# EAGLE design ADXL372_circuit (EAGLE 9.5.1)

## Sheet 1 of 2
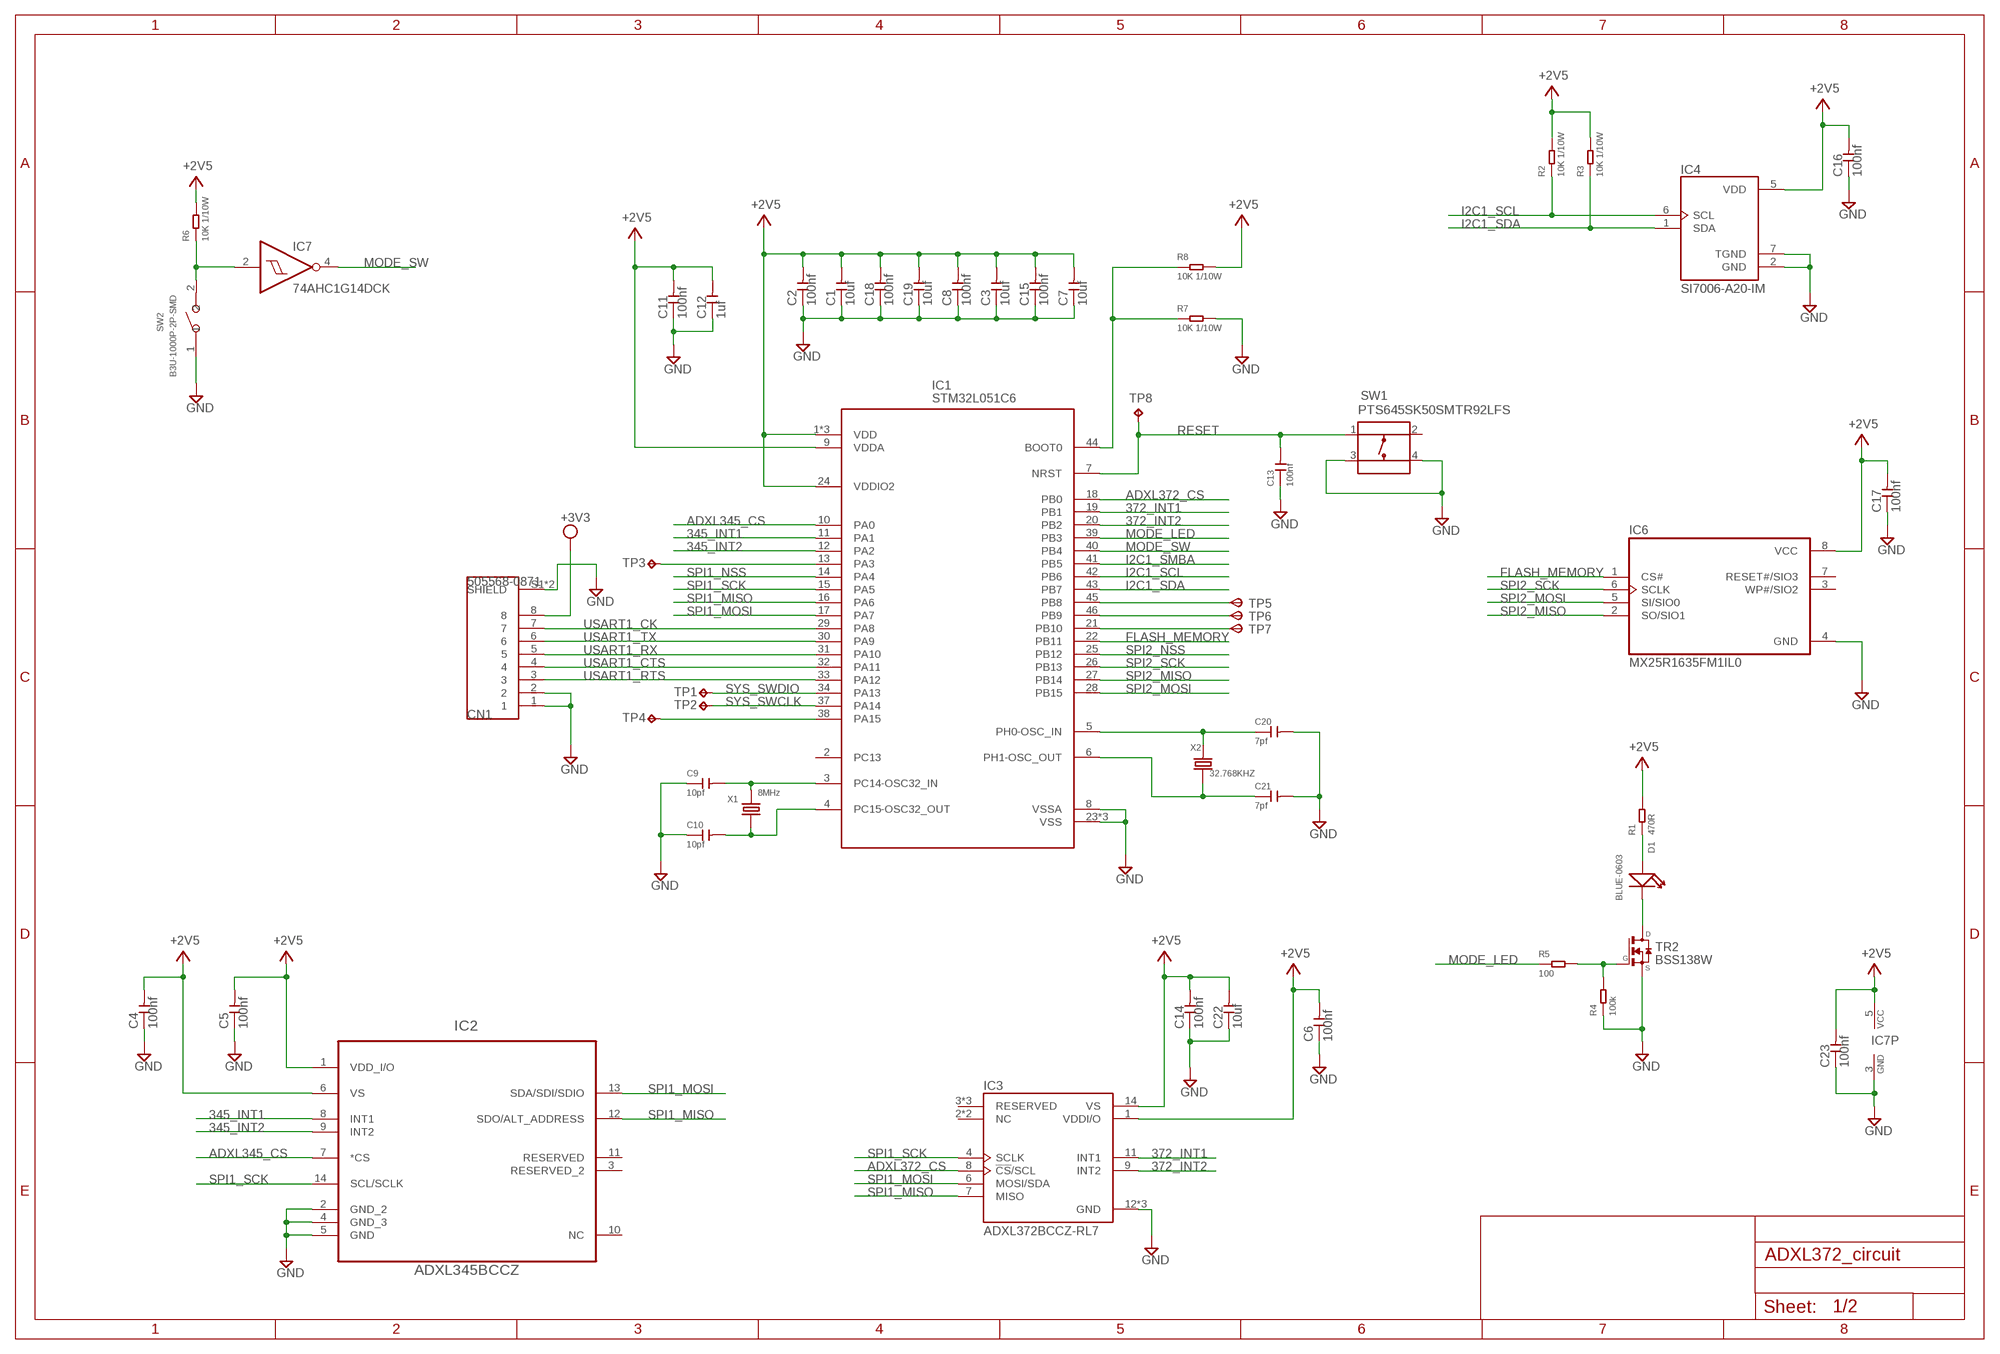
[diagram p0: schematic, sheet 1]

### Parts
C1  10uf  CERAMIC-10UF-10V-(-20%～+80%)-Y5V(0805)  [C0805]
C2  100nf  CERAMIC-100NF-50V-10%-X7R(0603)  [C0603]
C3  10uf  CERAMIC-10UF-10V-(-20%～+80%)-Y5V(0805)  [C0805]
C4  100nf  CERAMIC-100NF-50V-10%-X7R(0603)  [C0603]
C5  100nf  CERAMIC-100NF-50V-10%-X7R(0603)  [C0603]
C6  100nf  CERAMIC-100NF-50V-10%-X7R(0603)  [C0603]
C7  10uf  CERAMIC-10UF-10V-(-20%～+80%)-Y5V(0805)  [C0805]
C8  100nf  CERAMIC-100NF-50V-10%-X7R(0603)  [C0603]
C9  10pf  CERAMIC-10PF-50V-5%-NPO(0603)  [C0603]
C10  10pf  CERAMIC-10PF-50V-5%-NPO(0603)  [C0603]
C11  100nf  CERAMIC-100NF-50V-10%-X7R(0603)  [C0603]
C12  1uf  CERAMIC-1UF-25V-10%-X7R(0805)  [C0805]
C13  100nf  CERAMIC-100NF-50V-10%-X7R(0603)  [C0603]
C14  100nf  CERAMIC-100NF-50V-10%-X7R(0603)  [C0603]
C15  100nf  CERAMIC-100NF-50V-10%-X7R(0603)  [C0603]
C16  100nf  CERAMIC-100NF-50V-10%-X7R(0603)  [C0603]
C17  100nf  CERAMIC-100NF-50V-10%-X7R(0603)  [C0603]
C18  100nf  CERAMIC-100NF-50V-10%-X7R(0603)  [C0603]
C19  10uf  CERAMIC-10UF-10V-(-20%～+80%)-Y5V(0805)  [C0805]
C20  7pf  CERAMIC-10PF-50V-5%-NPO(0603)  [C0603]
C21  7pf  CERAMIC-10PF-50V-5%-NPO(0603)  [C0603]
C22  10uf  CERAMIC-10UF-10V-(-20%～+80%)-Y5V(0805)  [C0805]
C23  100nf  CERAMIC-100NF-50V-10%-X7R(0603)  [C0603]
CN1  505568-0871  [MOLEX_505568-0871]
D1  BLUE-0603  SMD-LED-CLEAR-BLUE(0603)  [LED-0603]
IC1  STM32L051C6  [LQFP48]
IC2  ADXL345BCCZ  [LGA14R80P3X6_300X500X100]
IC3  ADXL372BCCZ-RL7  [PQFN50P322X300X114-16N]
IC4  SI7006-A20-IM  [SON100P300X300X80-7N]
IC6  MX25R1635FM1IL0  [SOIC127P600X175-8N]
IC7  74AHC1G14DCK  [SC70-5]
R1  470R  SMD-RES-470R-5%-1/10W(0603)  [R0603]
R2  10K 1/10W  SMD-RES-10K-5%-1/10W(0603)  [R0603]
R3  10K 1/10W  SMD-RES-10K-5%-1/10W(0603)  [R0603]
R4  100k  SMD-RES-470R-5%-1/10W(0603)  [R0603]
R5  100  SMD-RES-470R-5%-1/10W(0603)  [R0603]
R6  10K 1/10W  SMD-RES-10K-5%-1/10W(0603)  [R0603]
R7  10K 1/10W  SMD-RES-10K-5%-1/10W(0603)  [R0603]
R8  10K 1/10W  SMD-RES-10K-5%-1/10W(0603)  [R0603]
SW1  PTS645SK50SMTR92LFS  [SW_PTS645SK50SMTR92LFS]
SW2  B3U-1000P-2P-SMD  SMD-BUTTON(2P-3.0X2.5X1.2+0.4MM)-B3U-1000P-2P-SMD  [SW2-2.6-3.0X2.5X1.2+0.4MM]
TP1  TPB1,27  [B1,27]
TP2  TPB1,27  [B1,27]
TP3  TPB1,27  [B1,27]
TP4  TPB1,27  [B1,27]
TP5  TPSB1,27  [B1,27]
TP6  TPSB1,27  [B1,27]
TP7  TPSB1,27  [B1,27]
TP8  TPB1,27  [B1,27]
TR2  BSS138W  [SOT323-R]
X1  8MHz  SMD-CRYSTAL-16MHZ-8PF-20PPM-40R(2P-5.0X3.2MM)  [X2-SMD-5.0X3.2X1.3MM]
X2  32.768KHZ  SMD-CRYSTAL-32.768KHZ-12.5PF-20PPM-90K(2P-L2.0X1.2MM)  [X2-SMD-L2.0X1.2X0.55MM]

### Nets
345_INT1: IC1.11(PA1) IC2.8(INT1)
345_INT2: IC1.12(PA2) IC2.9(INT2)
372_INT1: IC1.19(PB1) IC3.11(INT1)
372_INT2: IC1.20(PB2) IC3.9(INT2)
+2V5: C1.2 C2.2 C3.2 C4.2 C5.2 C6.2 C7.2 C8.2 C11.2 C12.2 C14.2 C15.2 C16.2 C17.2 C18.2 C19.2 C22.2 C23.2 IC1.1(VDD) IC1.9(VDDA) IC1.24(VDDIO2) IC1.36(VDD) IC1.48(VDD) IC2.1(VDD_I/O) IC2.6(VS) IC3.1(VDDI/O) IC3.14(VS) IC4.5(VDD) IC6.8(VCC) IC7.5(VCC) R1.2 R2.2 R3.2 R6.2 R8.2 ; also sheet 2
+3V3: CN1.8 ; also sheet 2
ADXL345_CS: IC1.10(PA0) IC2.7(*CS)
ADXL372_CS: IC1.18(PB0) IC3.8(!CS!/SCL)
FLASH_MEMORY: IC1.22(PB11) IC6.1(CS#)
GND: C1.1 C2.1 C3.1 C4.1 C5.1 C6.1 C7.1 C8.1 C9.1 C10.1 C11.1 C12.1 C13.1 C14.1 C15.1 C16.1 C17.1 C18.1 C19.1 C20.2 C21.2 C22.1 C23.1 CN1.1 CN1.2 CN1.S1(SHIELD) CN1.S2(SHIELD) IC1.8(VSSA) IC1.23(VSS) IC1.35(VSS) IC1.47(VSS) IC2.2(GND_2) IC2.4(GND_3) IC2.5(GND) IC3.12(GND) IC3.13(GND) IC3.16(GND) IC4.2(GND) IC4.7(TGND) IC6.4(GND) IC7.3(GND) R4.1 R7.2 SW1.3 SW1.4 SW2.1 TR2.2(S) ; also sheet 2
I2C1_SCL: IC1.42(PB6) IC4.6(SCL) R2.1
I2C1_SDA: IC1.43(PB7) IC4.1(SDA) R3.1
I2C1_SMBA: IC1.41(PB5)
MODE_LED: IC1.39(PB3) R5.1
MODE_SW: IC1.40(PB4) IC7.4(O)
N$1: C9.2 IC1.3(PC14-OSC32_IN) X1.2
N$2: C10.2 IC1.4(PC15-OSC32_OUT) X1.1
N$4: R4.2 R5.2 TR2.1(G)
N$5: IC7.2(I) R6.1 SW2.2
N$6: IC1.13(PA3) TP3.TP
N$7: IC1.38(PA15) TP4.TP
N$12: IC1.44(BOOT0) R7.1 R8.1
N$14: C20.1 IC1.5(PH0-OSC_IN) X2.2
N$15: C21.1 IC1.6(PH1-OSC_OUT) X2.1
N$18: D1.+ R1.1
N$19: D1.- TR2.3(D)
RESET: C13.2 IC1.7(NRST) SW1.1 TP8.TP
SPI1_MISO: IC1.16(PA6) IC2.12(SDO/ALT_ADDRESS) IC3.7(MISO)
SPI1_MOSI: IC1.17(PA7) IC2.13(SDA/SDI/SDIO) IC3.6(MOSI/SDA)
SPI1_NSS: IC1.14(PA4)
SPI1_SCK: IC1.15(PA5) IC2.14(SCL/SCLK) IC3.4(SCLK)
SPI2_MISO: IC1.27(PB14) IC6.2(SO/SIO1)
SPI2_MOSI: IC1.28(PB15) IC6.5(SI/SIO0)
SPI2_NSS: IC1.25(PB12)
SPI2_SCK: IC1.26(PB13) IC6.6(SCLK)
SYS_SWCLK: IC1.37(PA14) TP2.TP
SYS_SWDIO: IC1.34(PA13) TP1.TP
TP5: IC1.45(PB8) TP5.TP(PP)
TP6: IC1.46(PB9) TP6.TP(PP)
TP7: IC1.21(PB10) TP7.TP(PP)
USART1_CK: CN1.7 IC1.29(PA8)
USART1_CTS: CN1.4 IC1.32(PA11)
USART1_RTS: CN1.3 IC1.33(PA12)
USART1_RX: CN1.5 IC1.31(PA10)
USART1_TX: CN1.6 IC1.30(PA9)
Unconnected: IC1.2(PC13) IC2.3(RESERVED_2) IC2.10(NC) IC2.11(RESERVED) IC3.2(NC) IC3.3(RESERVED) IC3.5(RESERVED) IC3.10(RESERVED) IC3.15(NC) IC6.3(WP#/SIO2) IC6.7(RESET#/SIO3) SW1.2

## Sheet 2 of 2
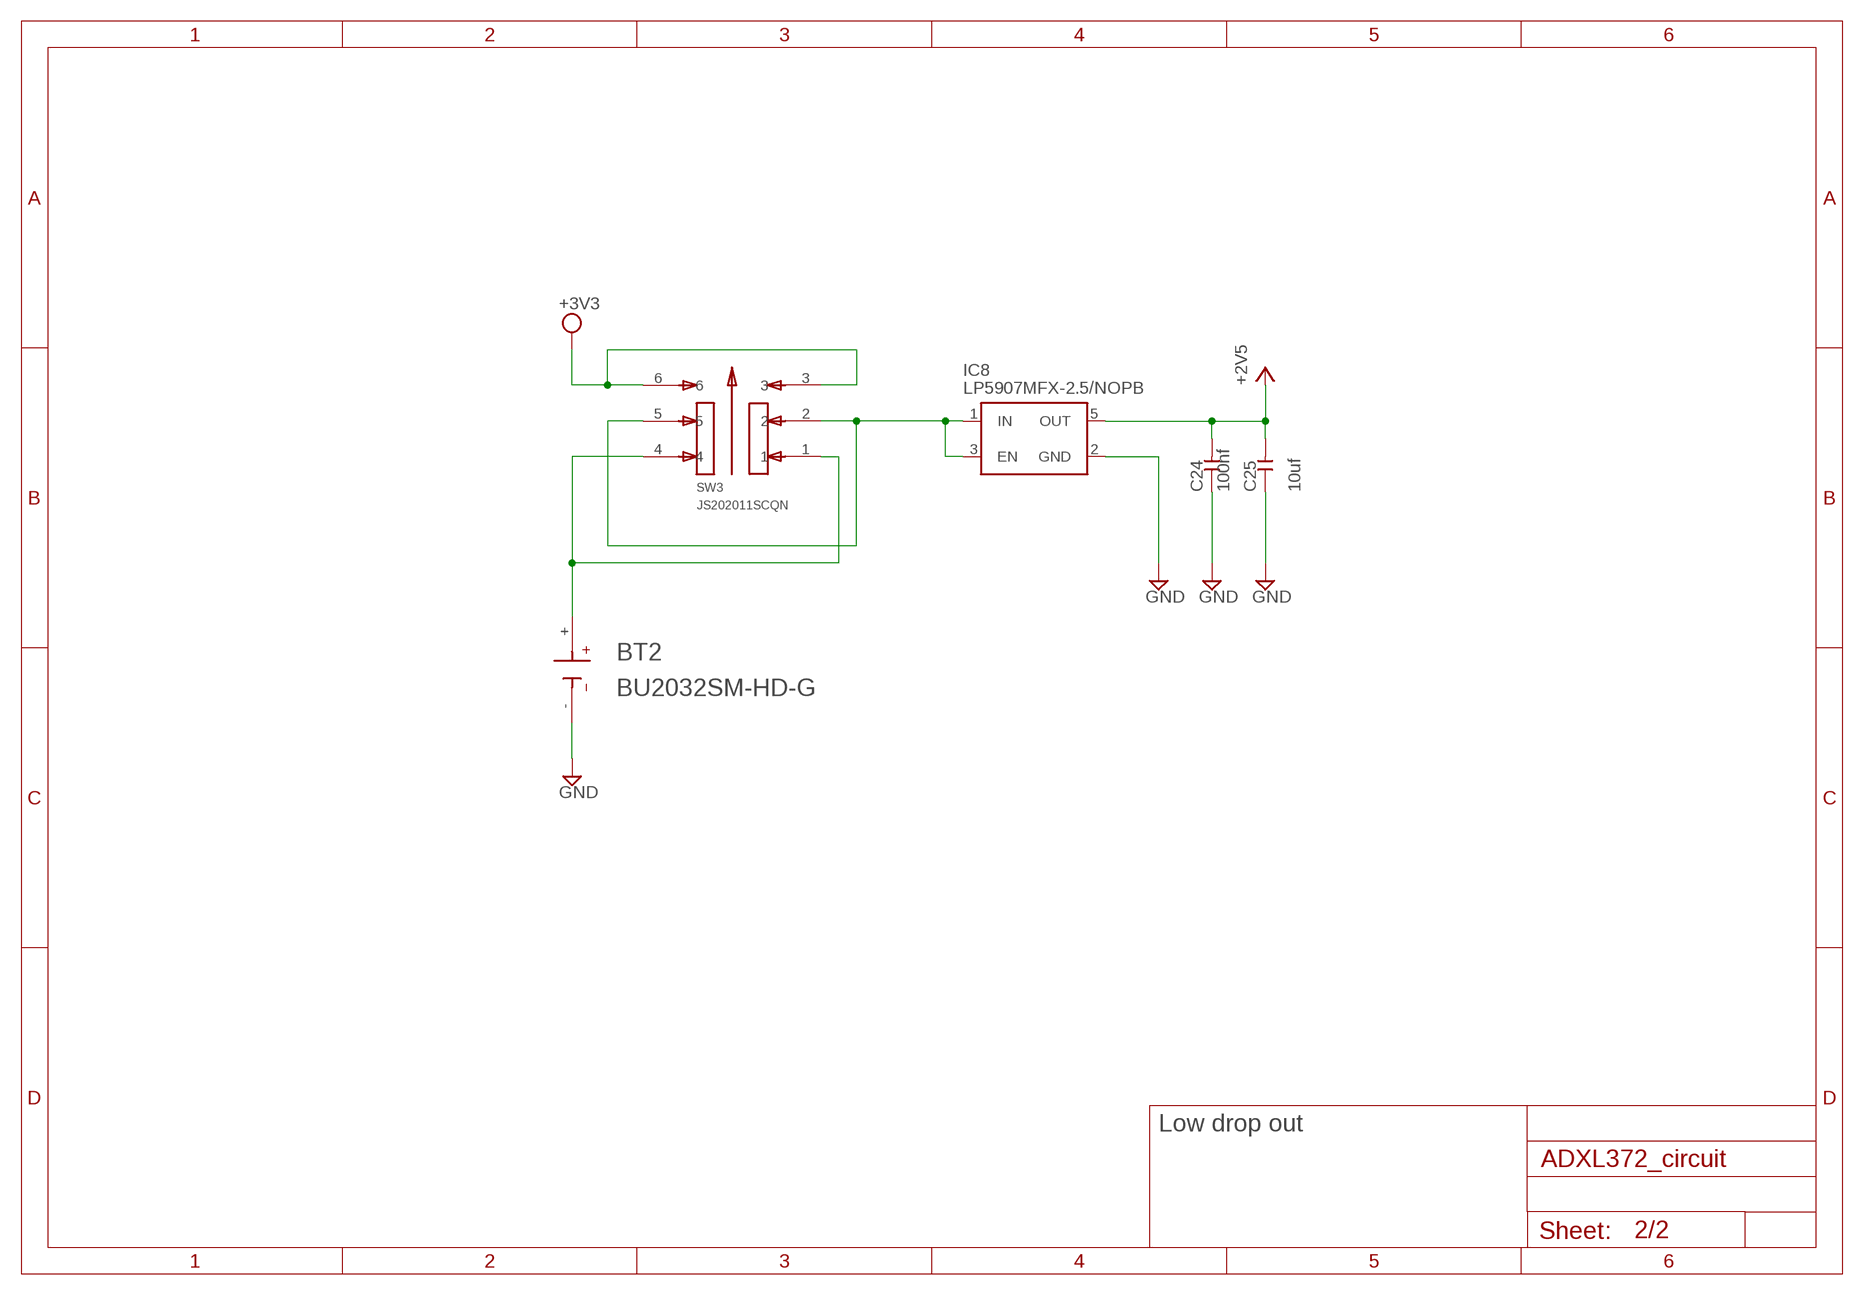
[diagram p1: schematic, sheet 2]

### Parts
BT2  BU2032SM-HD-G  [BAT_BU2032SM-HD-G]
C24  100nf  CERAMIC-100NF-50V-10%-X7R(0603)  [C0603]
C25  10uf  CERAMIC-10UF-10V-(-20%～+80%)-Y5V(0805)  [C0805]
IC8  LP5907MFX-2.5/NOPB  [SOT95P280X145-5N]
SW3  JS202011SCQN  [SW_JS202011SCQN]

### Nets
+2V5: C24.2 C25.2 IC8.5(OUT) ; also sheet 1
+3V3: SW3.3 SW3.6 ; also sheet 1
+BAT: BT2.+ SW3.1 SW3.4
+VIN: IC8.1(IN) IC8.3(EN) SW3.2 SW3.5
GND: BT2.- C24.1 C25.1 IC8.2(GND) ; also sheet 1

### Notes on the sheet
- Low drop out

## Library data of the parts
BT2 = BU2032SM-HD-G:BU2032SM-HD-G: Batt Holder Smt Coin 20mm Tape; DESCRIPTION: BATTERY HOLDER COIN 20MM SMD; DIGI-KEY_PART_NUMBER: BU2032SM-HD-GCT-ND; DIGI-KEY_PURCHASE_URL: https://www.digikey.jp/product-detail/en/mpd-memory-protection-devices/BU2032SM-HD-G/BU2032SM-HD-GCT-ND/755451?utm_source=snapeda&utm_medium=aggregator&utm_campaign=symbol; MF: MPD _Memory; MP: BU2032SM-HD-G; PACKAGE: None
C1 C3 C7 C19 C22 C25 = OPL_Capacitor:CERAMIC-10UF-10V-(-20%～+80%)-Y5V(0805): 302010158; MPN: CC0805ZKY5V6BB106
C2 C4-C6 C8 C11 C13-C18 C23 C24 = OPL_Capacitor:CERAMIC-100NF-50V-10%-X7R(0603): 302010138; MPN: CC0603KRX7R9BB104
C9 C10 = OPL_Capacitor:CERAMIC-10PF-50V-5%-NPO(0603): 302010097; MPN: CC0603JRNPO9BN100
C12 = OPL_Capacitor:CERAMIC-1UF-25V-10%-X7R(0805): 302010179; MPN: CC0805KKX7R8BB105
C20 C21 = OPL_Capacitor:CERAMIC-10PF-50V-5%-NPO(0603): 302010097; MPN: CC0603JRNPO9BN100; VALUE: 10pf
CN1 = 505568-0871:505568-0871: Micro-Lock PLUS Vertical Header 1.25mm Pitch Single Row 8 Circuits Tin-Bismuth Plating Polyamide Black Emboss T/R; AVAILABILITY: Unavailable; DESCRIPTION: Headers & Wire Housings MicroLockPlus 1.25MM VERT HDR SR 8CKT BLK; MF: Molex; MP: 505568-0871; PACKAGE: None; PRICE: None
D1 = Seeed-LED:SMD-LED-CLEAR-BLUE(0603): 304090045; MPN: 19-217-BHC-ZL1M2RY-3T
IC1 = stm32l05x6:STM32L051C6
IC2 = ADXL345BCCZ:ADXL345BCCZ: IC, ACCELEROMETER, 3AXIS; DESCRIPTION: Lga 14/i¡/Small, Ultra Low Power, 3-Axis, ±2/4/8/16g Digital Accelerometer; DIGI-KEY_PART_NUMBER: ADXL345BCCZ-ND; DIGI-KEY_PURCHASE_URL: https://www.digikey.jp/product-detail/en/analog-devices-inc/ADXL345BCCZ/ADXL345BCCZ-ND/2034829?utm_source=snapeda&utm_medium=aggregator&utm_campaign=symbol; MF: Analog Devices; MP: ADXL345BCCZ; PACKAGE: LGA-14 Analog Devices
IC3 = ADXL372BCCZ-RL7:ADXL372BCCZ-RL7: Micropower, 3-Axis, ±200 g Digital Output, MEMS; DIGI-KEY_PART_NUMBER: ADXL372BCCZ-RL7CT-ND; DIGI-KEY_PURCHASE_URL: https://www.digikey.jp/product-detail/en/analog-devices-inc/ADXL372BCCZ-RL7/ADXL372BCCZ-RL7CT-ND/7019671?utm_source=snapeda&utm_medium=aggregator&utm_campaign=symbol; MF: Analog Devices; MP: ADXL372BCCZ-RL7; PACKAGE: LGA-16 Analog Devices
IC4 = SI7006-A20-IM:SI7006-A20-IM: SENS HUMI/TEMP 3.6V I2C 5% 6DFN; AVAILABILITY: Unavailable; DESCRIPTION: Temp/Humidity Sensor, +/-1deg c, Dfn-6; MF: Silicon Labs; MP: SI7006-A20-IM; PACKAGE: DFN-6 Silicon Labs; PRICE: None
IC6 = MX25R1635FM1IL0:MX25R1635FM1IL0: None; AVAILABILITY: Unavailable; DESCRIPTION: 16 Mb NOR Serial flash 8-SOIC 1.65-3.6 VOLT ULTRA LOW POWER; MF: Macronix; MP: MX25R1635FM1IL0; PACKAGE: SOP-8 Macronix; PRICE: None
IC7 = 74xx-little-us:74*1G14: Single Schmitt-Trigger Inverter Gate
IC8 = LP5907MFX-2.5_NOPB:LP5907MFX-2.5/NOPB: 250mA, Ultra-Low Noise Low-Dropout egulator 5-SOT-23 -40 to 125; DESCRIPTION: 250mA, Ultra-Low Noise Low-Dropout egulator 5-SOT-23 -40 to 125; DIGI-KEY_PART_NUMBER: 296-40356-1-ND; DIGI-KEY_PURCHASE_URL: https://www.digikey.jp/product-detail/en/texas-instruments/LP5907MFX-2.5-NOPB/296-40356-1-ND/5178233?utm_source=snapeda&utm_medium=aggregator&utm_campaign=symbol; MF: Texas Instruments; MP: LP5907MFX-2.5/NOPB; PACKAGE: SOT-23 Texas Instruments
R1 = OPL_Resistor:SMD-RES-470R-5%-1/10W(0603): 301010088; MPN: RC0603JR-07470RL
R2 R3 R6-R8 = OPL_Resistor:SMD-RES-10K-5%-1/10W(0603): 301010293; MPN: RC0603JR-0710KL
R4 R5 = OPL_Resistor:SMD-RES-470R-5%-1/10W(0603): 301010088; MPN: RC0603JR-07470RL; VALUE: 470R
SW1 = PTS645SK50SMTR92LFS:PTS645SK50SMTR92LFS: Switch Tactile N.O. SPST Round Button Gull Wing 0.05A 12VDC 100000Cycles 2.55N SMD T/R; AVAILABILITY: Unavailable; DESCRIPTION: Switch Tactile N.O. SPST Round Button Gull Wing 0.05A 12VDC 100000Cycles 2.55N SMD T/R; MF: C&K; MP: PTS645SK50SMTR92LFS; PACKAGE: None; PRICE: None
SW2 = OPL_Switch:SMD-BUTTON(2P-3.0X2.5X1.2+0.4MM): 311020047; MPN: B3U-1000P-2P-SMD
SW3 = JS202011SCQN:JS202011SCQN: JS Series DPDT On-On Gull Wing Surface Mount Subminiature Slide Switch; DESCRIPTION: JS Series DPDT On-On Gull Wing Surface Mount Subminiature Slide Switch; DIGI-KEY_PART_NUMBER: 401-2002-1-ND; DIGI-KEY_PURCHASE_URL: https://www.digikey.jp/product-detail/en/c-k/JS202011SCQN/401-2002-1-ND/1640098?utm_source=snapeda&utm_medium=aggregator&utm_campaign=symbol; MF: C&K; MP: JS202011SCQN; PACKAGE: None
TP1-TP4 TP8 = testpad:TP: Test pad
TP5-TP7 = testpad:TPS: TEST PIN
TR2 = BSS138W:BSS138W: N-Channel MOSFET; DESCRIPTION: N-Channel 50 V 3.5 Ohm SMT Enhancement Mode Field Effect Transistor - SOT-323; DIGI-KEY_PART_NUMBER: BSS138WCT-ND; DIGI-KEY_PURCHASE_URL: https://www.digikey.jp/product-detail/en/on-semiconductor/BSS138W/BSS138WCT-ND/3907886?utm_source=snapeda&utm_medium=aggregator&utm_campaign=symbol; MF: ON Semiconductor; MP: BSS138W; PACKAGE: SOT-323 ON Semiconductor
X1 = OPL_Crystal Oscillator:SMD-CRYSTAL-16MHZ-8PF-20PPM-40R(2P-5.0X3.2MM): 306010054; MPN: X053201602002; VALUE: 16MHZ
X2 = OPL_Crystal Oscillator:SMD-CRYSTAL-32.768KHZ-12.5PF-20PPM-90K(2P-L2.0X1.2MM): 306010020; MPN: FC-12M; VALUE: 3.2768KHZ

## Net classes
0 default: width 0.152 mm, clearance 0.205 mm

## Board
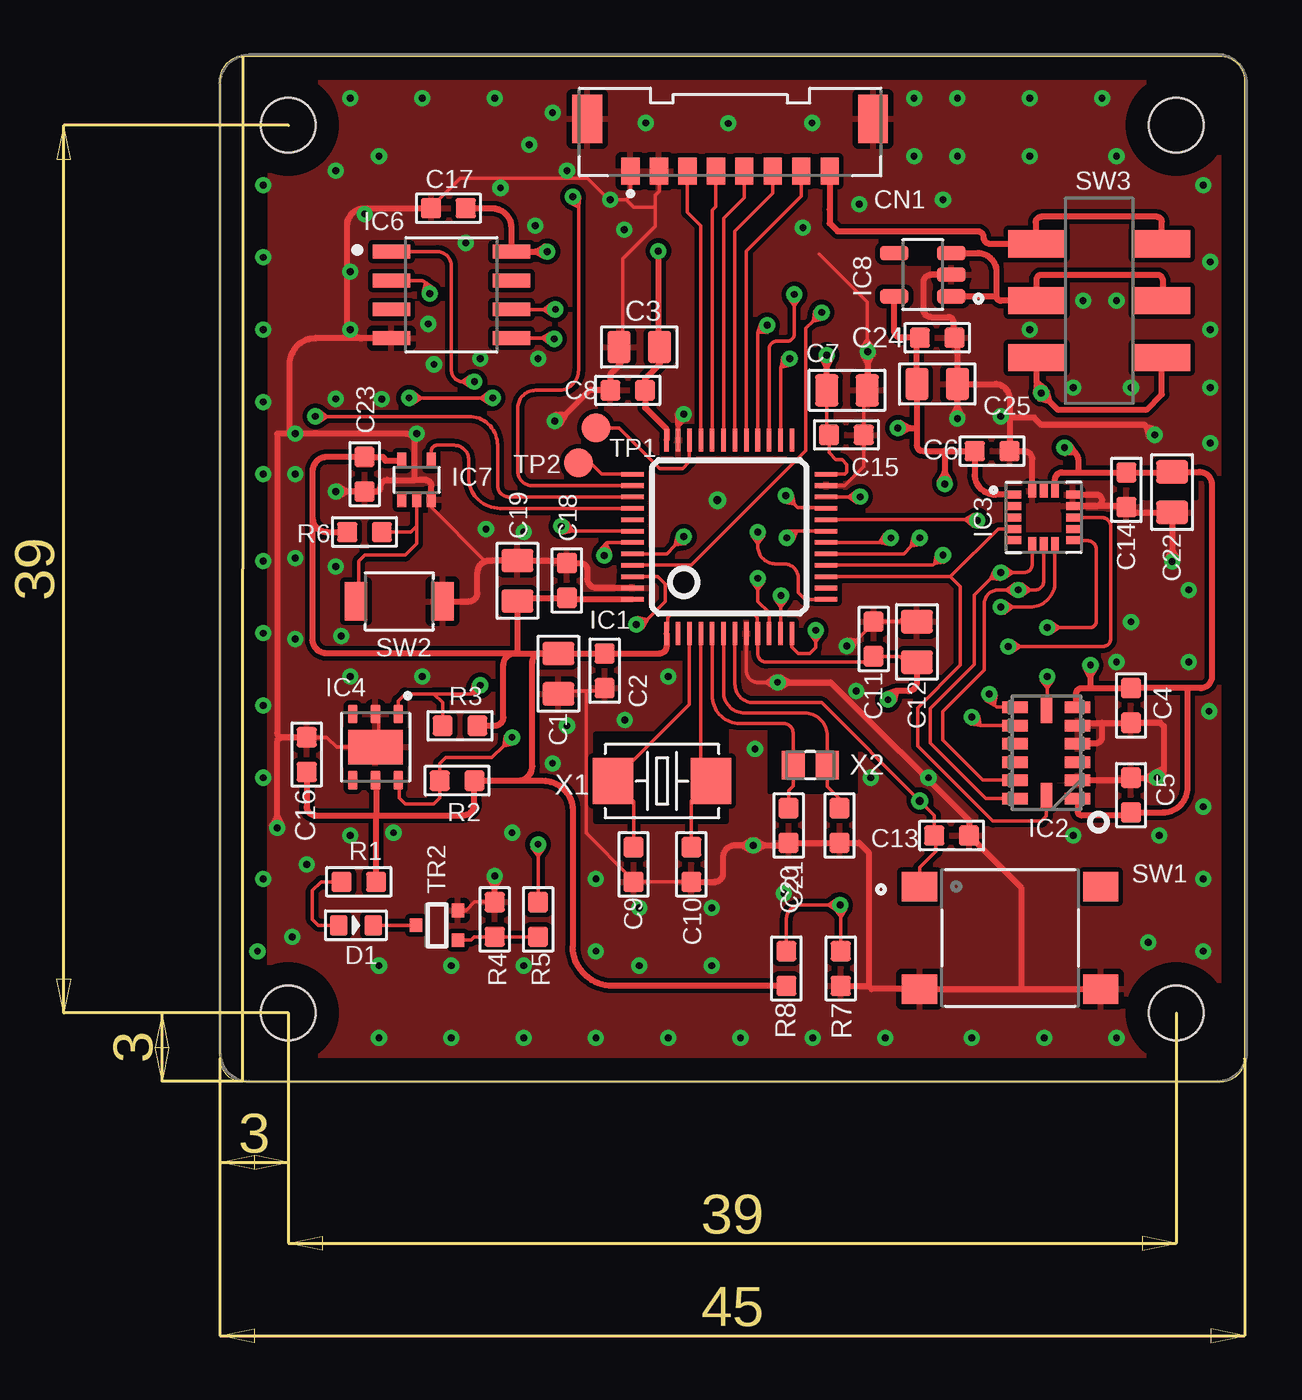
[diagram p2: board, top side]
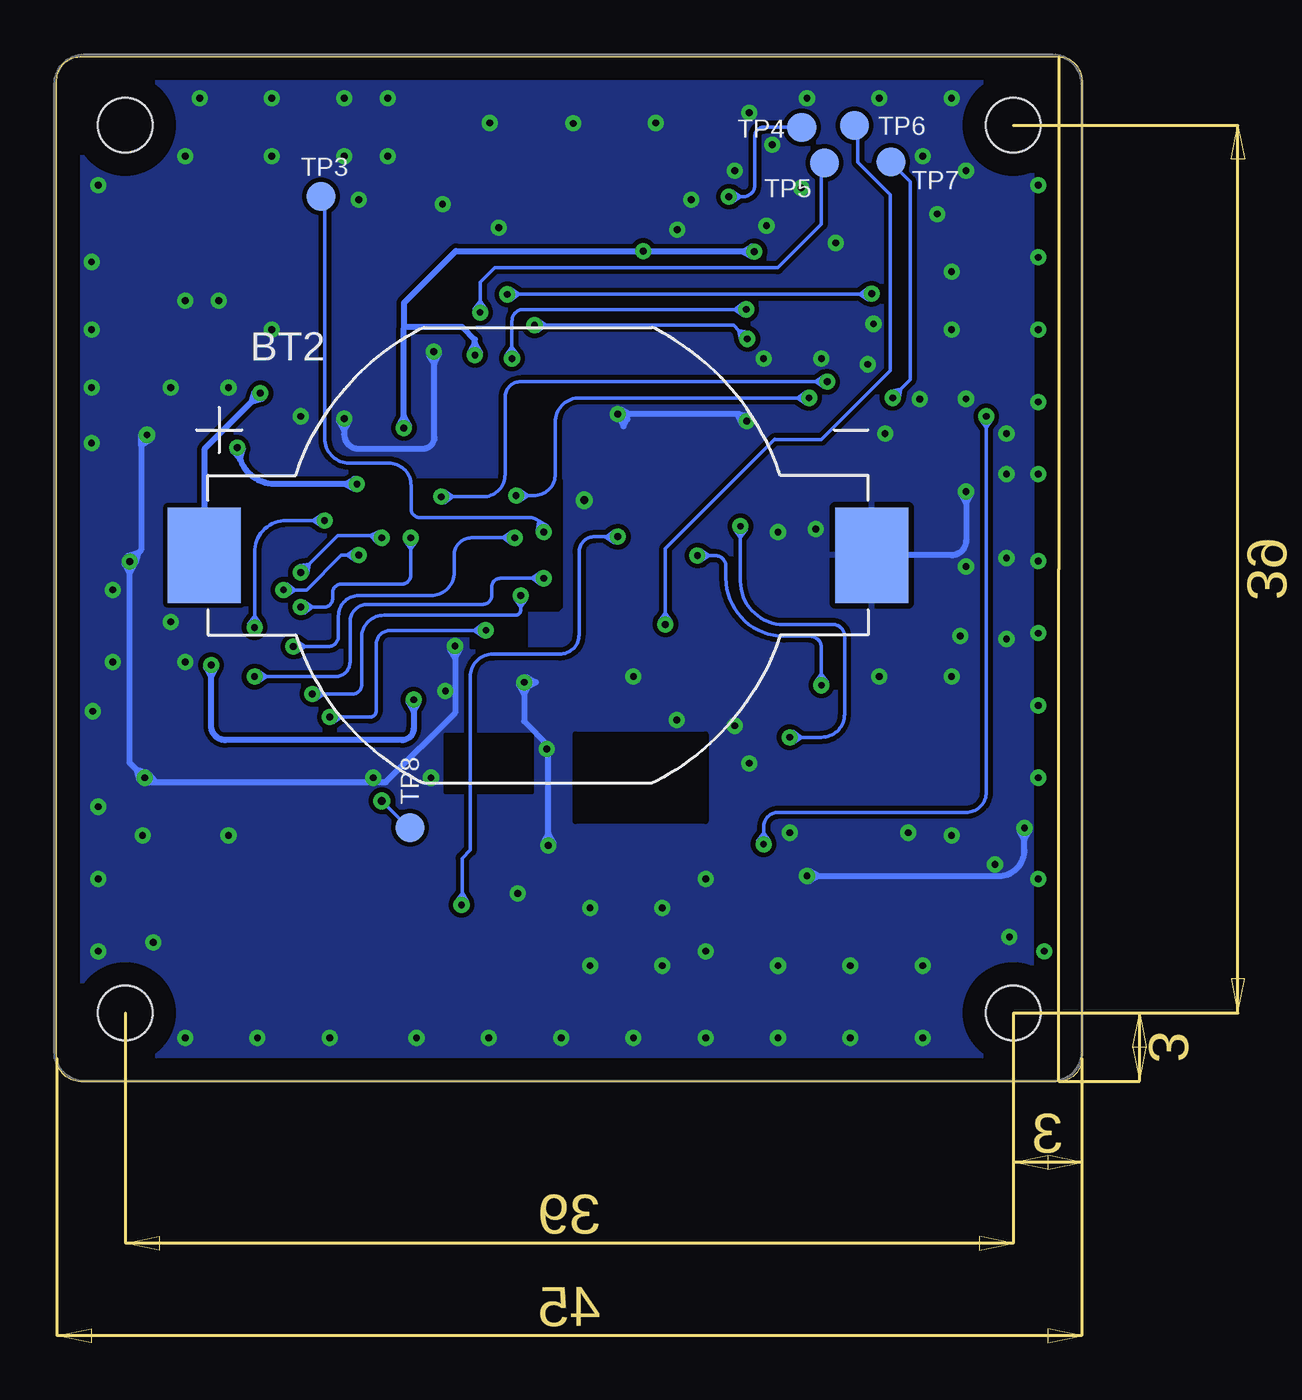
[diagram p3: board, bottom side, seen from below]

Size 45 x 45 mm. Coordinates in mm from the lower left corner, seen from the top.
Outline: 0,44 0,1 arc90 1,0 44,0 arc90 45,1 45,44 arc90 44,45 1,45 arc90 0,44
Copper layers (1*16): Top 0.035mm / dielectric 1.5mm / Bottom 0.035mm
Design rules "default *": minimum track width 6mil, minimum drill 0.3mm, track to track 4mil, track to pad 4mil, pad to pad 4mil, via to via 6mil, smd to smd 4mil, copper to edge 40mil, drill to drill 6mil, minimum pad ring 10mil, minimum via ring 8mil, stop-mask expansion 4mil, vias tented up to drill 0mil, thermal gap 10mil
Holes 2.4 mm at 3,3 42,3 3,42 42,42

### Footprints (pad centres in the part's own frame; a part is rotated, then mirrored left to right if it is on the bottom)
BAT_BU2032SM-HD-G = smd 3.2 x 4.2: + -14.65,0; - 14.65,0
C0805 = smd 1.397 x 1.016: 1 0,0.889; 2 0,-0.889
C0603 = smd 0.889 x 0.889: 1 0,0.762; 2 0,-0.762
MOLEX_505568-0871 = smd 0.8 x 1.2: 1 -4.375,0; 2 -3.125,0; 3 -1.875,0; 4 -0.625,0; 5 0.625,0; 6 1.875,0; 7 3.125,0; 8 4.375,0 | smd 1.3 x 2.15: S1 -6.275,2.295; S2 6.275,2.295
LED-0603 = smd 0.762 x 0.889: + -0.762,0; - 0.762,0
LQFP48 = smd 0.2 x 1: 1 -2.75,-4.25; 2 -2.25,-4.25; 3 -1.75,-4.25; 4 -1.25,-4.25; 5 -0.75,-4.25; 6 -0.25,-4.25; 7 0.25,-4.25; 8 0.75,-4.25; 9 1.25,-4.25; 10 1.75,-4.25; 11 2.25,-4.25; 12 2.75,-4.25; 25 2.75,4.25; 26 2.25,4.25; 27 1.75,4.25; 28 1.25,4.25; 29 0.75,4.25; 30 0.25,4.25; 31 -0.25,4.25; 32 -0.75,4.25; 33 -1.25,4.25; 34 -1.75,4.25; 35 -2.25,4.25; 36 -2.75,4.25 | smd 1 x 0.2: 13 4.25,-2.75; 14 4.25,-2.25; 15 4.25,-1.75; 16 4.25,-1.25; 17 4.25,-0.75; 18 4.25,-0.25; 19 4.25,0.25; 20 4.25,0.75; 21 4.25,1.25; 22 4.25,1.75; 23 4.25,2.25; 24 4.25,2.75; 37 -4.25,2.75; 38 -4.25,2.25; 39 -4.25,1.75; 40 -4.25,1.25; 41 -4.25,0.75; 42 -4.25,0.25; 43 -4.25,-0.25; 44 -4.25,-0.75; 45 -4.25,-1.25; 46 -4.25,-1.75; 47 -4.25,-2.25; 48 -4.25,-2.75
LGA14R80P3X6_300X500X100 = smd 1.118 x 0.508: 1 -1.372,2.007; 2 -1.372,1.194; 3 -1.372,0.406; 4 -1.372,-0.406; 5 -1.372,-1.194; 6 -1.372,-2.007; 8 1.372,-2.007; 9 1.372,-1.194; 10 1.372,-0.406; 11 1.372,0.406; 12 1.372,1.194; 13 1.372,2.007 | smd 0.508 x 1.118: 7 0,-1.88; 14 0,1.88
PQFN50P322X300X114-16N = smd 0.6 x 0.35: 1 -1.285,1; 2 -1.285,0.5; 3 -1.285,0; 4 -1.285,-0.5; 5 -1.285,-1; 9 1.285,-1; 10 1.285,-0.5; 11 1.285,0; 12 1.285,0.5; 13 1.285,1 | smd 0.35 x 0.6: 6 -0.5,-1.165; 7 0,-1.165; 8 0.5,-1.165; 14 0.5,1.165; 15 0,1.165; 16 -0.5,1.165
SON100P300X300X80-7N = smd 0.81 x 0.42: 1 -1.45,1; 2 -1.45,0; 3 -1.45,-1; 4 1.45,-1; 5 1.45,0; 6 1.45,1 | smd 1.5 x 2.4: 7 0,0
SOIC127P600X175-8N = smd 1.65 x 0.61: 1 -2.635,1.905; 2 -2.635,0.635; 3 -2.635,-0.635; 4 -2.635,-1.905; 5 2.635,-1.905; 6 2.635,-0.635; 7 2.635,0.635; 8 2.635,1.905
SC70-5 = smd 0.4 x 0.7: 1 -0.65,-0.85; 2 0,-0.85; 3 0.65,-0.85; 4 0.65,0.85; 5 -0.65,0.85
SOT95P280X145-5N = smd 1.27 x 0.635: 1 -1.255,0.95; 2 -1.255,0; 3 -1.255,-0.95; 4 1.255,-0.95; 5 1.255,0.95
R0603 = smd 0.889 x 0.889: 1 0,0.762; 2 0,-0.762
SW_PTS645SK50SMTR92LFS = smd 1.55 x 1.3: 1 -3.975,2.25; 2 3.975,2.25; 3 -3.975,-2.25; 4 3.975,-2.25
SW2-2.6-3.0X2.5X1.2+0.4MM = smd 1 x 1.7: 1 -1.9,0; 2 1.9,0
SW_JS202011SCQN = smd 1.2 x 2.5: 1 -2.5,-2.75; 2 0,-2.75; 3 2.5,-2.75; 4 -2.5,2.75; 5 0,2.75; 6 2.5,2.75
B1,27 = smd 1.27 x 1.27: TP 0,0
SOT323-R = smd 0.6 x 0.55: 1 -0.65,-0.925; 2 0.65,-0.925; 3 0,0.925
X2-SMD-5.0X3.2X1.3MM = smd 1.778 x 2.032: 1 -2.159,0; 2 2.159,0
X2-SMD-L2.0X1.2X0.55MM = smd 1 x 1.25: 1 -0.75,0; 2 0.75,0

### Placement (x,y rotation side)
BT2  23.88,23.11 0 bottom
C1  14.86,17.91 180 top
C2  16.89,18.03 180 top
C3  18.41,32.26 90 top
C4  40.01,16.51 180 top
C5  40.01,12.57 0 top
C6  33.91,27.69 270 top
C7  27.53,30.35 270 top
C8  17.91,30.35 90 top
C9  18.16,9.53 180 top
C10  20.7,9.53 180 top
C11  28.7,19.43 0 top
C12  30.61,19.3 0 top
C13  32.13,10.79 270 top
C14  39.8,25.98 180 top
C15  27.51,28.4 270 top
C16  3.81,14.35 0 top
C17  10.03,38.35 90 top
C18  15.24,22 0 top
C19  13.06,21.99 0 top
C20  24.97,11.24 0 top
C21  27.21,11.24 0 top
C22  41.81,25.88 180 top
C23  6.35,26.67 180 top
C24  31.5,32.66 270 top
C25  31.5,30.63 270 top
CN1  22.4,39.98 0 top
D1  5.97,6.86 0 top
IC1  22.36,23.92 0 top
IC2  36.29,14.43 180 top
IC3  36.17,24.77 0 top
IC4  6.83,14.68 270 top
IC6  10.16,34.54 0 top
IC7  8.64,26.42 0 top
IC8  30.86,35.43 180 top
R1  6.1,8.76 90 top
R2  10.41,13.21 90 top
R3  10.54,15.62 90 top
R4  12.06,7.11 0 top
R5  13.97,7.11 0 top
R6  6.35,24.13 270 top
R7  27.26,4.95 0 top
R8  24.87,4.95 0 top
SW1  34.7,6.3 0 top
SW2  7.87,21.08 180 top
SW3  38.61,34.29 90 top
TP1  16.51,28.7 0 top
TP2  15.75,27.18 0 top
TP3  33.4,38.86 0 bottom
TP4  12.29,41.91 0 bottom
TP5  11.3,40.34 0 bottom
TP6  9.98,41.99 0 bottom
TP7  8.38,40.39 0 bottom
TP8  29.49,11.15 0 bottom
TR2  9.53,6.86 90 top
X1  19.41,13.19 180 top
X2  25.92,13.89 180 top

### Tracks (layer width: path | path; a pad name or v marks a point on that pad's centre or on a via)
345_INT1  (via drill 0.3)
  Top 0.152: IC2.8 34.11,16.44 34,16.54 | v33.78,17.02 33.78,16.76 34,16.54 | IC1.11 24.61,20.81 | 24.61,20.81 24.61,21.31 v24.64,21.34 | 24.61,20.81 24.88,21.15 v24.64,21.34 | 24.61,20.81 24.38,21.17 v24.64,21.34 | 34,16.54 | 34,16.54 | 34,16.54 33.63,16.76 | 33.63,16.76 | 34,16.54 34.08,16.96 | 34.08,16.96 | v33.78,17.02 34.08,16.96 | 34,16.54 33.63,16.76 | v33.78,17.02 33.63,16.76 | 34,16.54 34.08,16.96 | v33.78,17.02 34.08,16.96 | 34,16.54 33.63,16.76 | v33.78,17.02 33.63,16.76
  Bottom 0.152: v33.78,17.02 33.26,17.02 | 33.26,17.02 32,17.02 arc-90 31.62,17.4 31.62,19.49 arc90 30.64,20.48 24.86,20.48 arc-90 24.64,20.7 24.64,20.81 | v24.64,21.34 24.64,20.81 | 24.64,20.81 24.89,21.16 v24.64,21.34 | 24.64,20.81 24.39,21.16 v24.64,21.34 | 33.26,17.02 33.61,16.77 v33.78,17.02 | 33.26,17.02 33.61,17.27 v33.78,17.02
345_INT2  (via drill 0.3)
  Top 0.152: 33.39,15.63 33.4,15.62 IC2.9 | 33.39,15.63 v33.02,16 | 26.16,19.29 26.16,19.05 25.91,18.8 25.4,18.8 25.11,19.08 IC1.12 | 26.16,19.29 | 26.16,19.29 v26.16,19.81 | 26.16,19.29 26.41,19.64 | 26.41,19.64 | 26.16,19.29 | 26.16,19.29 25.91,19.64 | 25.91,19.64 | 26.16,19.29 26.41,19.64 | 26.41,19.64 | v26.16,19.81 26.41,19.64 | 26.16,19.29 25.91,19.64 | v26.16,19.81 25.91,19.64 | 26.16,19.29 26.41,19.64 | v26.16,19.81 26.41,19.64 | 26.16,19.29 25.91,19.64 | v26.16,19.81 25.91,19.64 | 33.39,15.63 33.32,16.05 v33.02,16 | 33.39,15.63 32.97,15.7 v33.02,16
  Bottom 0.152: v26.16,19.81 26.69,19.81 | 26.69,19.81 | 26.69,19.81 30.35,19.81 arc-90 30.99,19.18 30.99,16.26 arc90 31.24,16 32.49,16 | 32.49,16 v33.02,16 | 26.69,19.81 26.34,20.06 | 26.34,20.06 | 26.69,19.81 | 26.69,19.81 26.34,19.57 | 26.34,19.57 | 26.69,19.81 26.34,20.06 | 26.34,20.06 | v26.16,19.81 26.34,20.06 | 26.69,19.81 26.34,19.57 | v26.16,19.81 26.34,19.57 | 26.69,19.81 26.34,20.06 | v26.16,19.81 26.34,20.06 | 26.69,19.81 26.34,19.57 | v26.16,19.81 26.34,19.57 | 32.49,16 32.85,15.76 v33.02,16 | 32.49,16 32.85,16.25 v33.02,16
372_INT1  (via drill 0.3)
  Top 0.152: v34.62,19.1 35.15,19.1 | 35.15,19.1 38.76,19.1 arc90 39.12,19.46 39.12,24.38 arc90 38.73,24.77 IC3.11 arc-90 IC3.11 | v24.89,23.88 arc-90 25.18,24.17 25.33,24.17 | 25.33,24.17 IC1.19 | 25.33,24.17 24.9,24.18 v24.89,23.88 | 25.33,24.17 25.17,23.77 v24.89,23.88 | 35.15,19.1 34.79,19.35 v34.62,19.1 | 35.15,19.1 34.79,18.85 v34.62,19.1
  Bottom 0.152: v24.89,23.88 25.42,23.88 | 25.42,23.88 26.8,23.88 arc-90 27.56,23.11 27.56,22.35 arc90 28.57,21.34 31.75,21.34 arc-90 32.64,20.45 32.64,19.56 arc90 33.1,19.1 34.09,19.1 | v34.62,19.1 34.09,19.1 | 25.42,23.88 25.07,24.12 v24.89,23.88 | 25.42,23.88 25.07,23.63 v24.89,23.88 | 34.09,19.1 34.45,18.85 v34.62,19.1 | 34.09,19.1 34.45,19.35 v34.62,19.1
372_INT2  (via drill 0.3)
  Top 0.152: v33.25,24.64 33.22,24.67 32.73,24.67 | 32.73,24.67 IC1.20 | v36.32,19.94 36.85,19.94 | 36.85,19.94 38.23,19.94 arc90 38.48,20.19 38.48,23.37 arc90 38.1,23.75 37.47,23.75 arc-90 IC3.9 | 32.73,24.67 33.06,24.4 v33.25,24.64 | 32.73,24.67 33.09,24.89 v33.25,24.64 | 36.85,19.94 36.5,20.19 v36.32,19.94 | 36.85,19.94 36.5,19.69 v36.32,19.94
  Bottom 0.152: v33.25,24.64 33.77,24.64 | 33.77,24.64 34.92,24.64 arc-90 36.32,23.24 36.32,20.46 | 36.32,20.46 v36.32,19.94 | 33.77,24.64 33.42,24.89 v33.25,24.64 | 33.77,24.64 33.42,24.39 v33.25,24.64 | 36.32,20.46 36.08,20.11 v36.32,19.94 | 36.32,20.46 36.57,20.11 v36.32,19.94
+2V5  (via drill 0.3)
  Top 0.152: 15.09,21.1 C18.2 | IC4.5 6.86,13.2 | C12.2 30.1,18.41 29.84,18.67 C11.2 28.45,18.41 24,18.41 arc-90 23.61,18.8 IC1.9 23.59,19.84 23.59,20.37 23.41,20.55 19.84,20.55 19.66,20.37 19.66,19.84 IC1.1 | IC1.24 27.43,26.67 27.53,26.77 27.53,27.1 27.33,27.3 27.05,27.3 26.75,27.61 C15.2 26.64,28.5 C7.2
  Top 0.254: IC3.1 34.05,25.77 arc-90 33.15,26.67 C6.2 31.83,27.69 | IC1.1 19.61,19.11 arc-90 19.3,18.8 C2.2 C1.2 14.1,18.8 | 15.09,21.1 arc90 C18.2 | IC1.48 15.3,21.17 arc-90 C18.2 | C17.2 11.94,38.35 arc-90 12.79,37.5 IC6.8 13.85,36.45 | IC7.5 7.28,27.27 arc-90 7.24,27.3 arc90 7.11,27.43 C23.2 4.7,27.43 arc90 4.06,26.8 4.06,24.77 | 13.85,36.45 v14.38,36.45 | IC2.1 37.66,11.87 arc90 37.85,11.68 39.88,11.68 C5.2 41.4,11.81 arc90 42.49,12.9 42.49,17.27 | IC2.6 arc-90 37.59,16.51 37.59,17.02 arc-90 37.85,17.27 38.23,17.27 | 38.23,17.27 C4.2 42.49,17.27 | C18.2 13.2,21.24 arc90 C19.2 13.06,18.9 arc-90 12.95,18.8 | 4.06,24.77 arc90 4.7,24.13 R6.2 | 37.69,26.75 36.97,26.75 arc90 36.67,26.44 IC3.14 | 37.69,26.75 C14.2 41.78,26.75 arc-90 C22.2 43,26.77 arc-90 43.56,26.21 43.56,17.78 arc-90 43.05,17.27 42.49,17.27 | 30.61,28.7 C25.2 30.61,32.54 C24.2 29.92,32.66 arc-90 29.61,32.98 IC8.5 | 30.61,28.7 30.61,27.94 arc90 30.86,27.69 31.83,27.69 | v38.23,18.29 38.23,17.76 | 38.23,17.76 38.23,17.27 | C12.2 30.61,17.53 arc-90 30.23,17.14 29.72,17.14 arc90 v29.34,16.76 | R1.2 6.86,11.68 | 6.86,13.2 arc90 IC4.5 arc-90 6.86,13.2 | C16.2 3.81,12.06 arc90 4.19,11.68 6.86,11.68 | 6.86,13.2 6.86,11.68 | 6.86,11.68 10.67,11.68 arc90 11.18,12.19 R2.2 | R3.2 12.06,15.62 arc90 12.45,16 12.45,18.29 arc-90 12.95,18.8 | 12.95,18.8 14.1,18.8 | 14.1,18.8 arc90 13.72,18.41 13.72,13.84 arc-90 13.08,13.21 R2.2 | 4.06,24.77 4.06,19.43 arc90 4.7,18.8 12.95,18.8 | v29.77,28.7 30.29,28.7 | 30.29,28.7 30.61,28.7 | C7.2 26.64,31.38 | 26.64,31.38 v26.64,31.9 | 31.83,27.69 31.83,26.76 | 31.83,26.76 v31.83,26.24 | v37.08,27.84 arc-90 37.69,27.23 37.69,26.75
  Top 0.254: R2.2 14.17,13.21 arc-90 15.49,11.89 15.49,5.94 arc90 17.25,4.19 R8.2 | IC1.36 19.61,28.64 18.67,29.59 C8.2 18.67,30.86 19.3,31.5 C3.2 19.25,32.31 v19.25,36.47 | 13.85,36.45 14.26,36.23 v14.38,36.45 | 13.85,36.45 14.26,36.67 v14.38,36.45 | 30.29,28.7 29.89,28.92 v29.77,28.7 | 30.29,28.7 29.89,28.48 v29.77,28.7 | v29.34,16.76 29.26,17 29.7,17.14 29.58,16.7 v29.34,16.76 | 38.23,17.76 38.45,18.17 v38.23,18.29 | 38.23,17.76 38.01,18.17 v38.23,18.29 | 26.64,31.38 26.86,31.78 v26.64,31.9 | 26.64,31.38 26.42,31.78 v26.64,31.9 | 31.83,26.76 31.61,26.36 v31.83,26.24 | 31.83,26.76 32.05,26.36 v31.83,26.24 | v37.08,27.84 37.29,27.99 37.56,27.61 37.1,27.59 v37.08,27.84
  Bottom 0.254: v14.38,36.45 14.9,36.45 | 14.9,36.45 19.23,36.45 | 19.23,36.45 19.32,36.45 | v29.34,16.76 29.34,16.24 | 29.34,16.24 29.34,15.49 arc90 29.84,14.99 37.59,14.99 arc90 38.23,15.62 38.23,17.76 | 38.23,17.76 v38.23,18.29 | v26.64,31.9 26.64,32.43 | 26.64,32.43 26.64,32.59 27.2,33.15 29.72,33.15 29.77,33.1 | v29.77,28.7 29.77,29.23 | 29.77,29.23 29.77,33.1 | 29.77,33.1 29.77,34.19 27.48,36.47 19.34,36.47 19.32,36.45 | v31.83,26.24 32.35,26.24 | 32.35,26.24 35.43,26.24 arc90 37.03,27.84 v37.08,27.84 | 14.9,36.45 14.5,36.67 v14.38,36.45 | 14.9,36.45 14.5,36.23 v14.38,36.45 | 29.77,29.23 29.55,28.82 v29.77,28.7 | 29.77,29.23 29.99,28.82 v29.77,28.7 | 29.34,16.24 29.56,16.64 v29.34,16.76 | 29.34,16.24 29.12,16.64 v29.34,16.76 | 38.23,17.76 38.45,18.17 v38.23,18.29 | 38.23,17.76 38.01,18.17 v38.23,18.29 | 26.64,32.43 26.42,32.02 v26.64,31.9 | 26.64,32.43 26.86,32.02 v26.64,31.9 | 32.35,26.24 31.95,26.46 v31.83,26.24 | 32.35,26.24 31.95,26.02 v31.83,26.24 | v37.08,27.84 37.27,27.67 36.95,27.33 36.84,27.78 v37.08,27.84 | 19.32,36.45 arc90 19.29,36.42 v19.25,36.47 arc-90 19.23,36.45
+3V3
  Top 0.254: SW3.3 41.36,37.76 arc90 41.15,37.97 36.07,37.97 arc90 35.81,37.72 35.81,36.83 arc90 SW3.6 33.82,36.79 arc-90 33.53,37.08 arc90 33.27,37.34 27.13,37.34 26.77,37.69 26.77,38.3 26.78,38.31 CN1.8
+BAT  (via drill 0.3)
  Top 0.254: 35.86,30.71 35.86,30.44 | 35.86,30.44 v36.07,30.23 | v36.07,30.23 36.44,29.86 | 36.44,29.86 36.8,29.49 40.66,29.49 41.36,30.18 SW3.1 | v36.07,30.23 arc-90 35.86,30.44 | 35.86,30.71 SW3.4 | 35.86,30.71 35.82,30.25 v36.07,30.23 | 35.86,30.71 36.22,30.42 v36.07,30.23 | 36.44,29.86 36.31,30.3 v36.07,30.23 | 36.44,29.86 36,29.98 v36.07,30.23
  Bottom 0.254: v36.07,30.23 36.44,29.86 | 36.44,29.86 38.53,27.77 BT2.+ | 36.44,29.86 36.31,30.3 v36.07,30.23 | 36.44,29.86 36,29.98 v36.07,30.23
+VIN
  Top 0.254: 34.1,34.48 34.1,35.56 arc90 33.27,36.38 IC8.3 | 34.1,34.48 arc90 34.29,34.29 SW3.5 35.86,35.22 arc-90 36.07,35.43 41.15,35.43 arc-90 41.4,35.18 41.4,34.33 arc-90 SW3.2 | IC8.1 34.1,34.48
ADXL345_CS  (via drill 0.3)
  Top 0.152: 23.62,21.57 23.62,21.08 24.11,20.59 IC1.10 | 23.62,21.57 | 23.62,21.57 v23.62,22.1 | IC2.7 36.32,16.34 36.32,17.25 | 36.32,17.25 | 36.32,17.25 v36.32,17.78 | 23.62,21.57 23.87,21.92 | 23.87,21.92 | 23.62,21.57 | 23.62,21.57 23.38,21.92 | 23.38,21.92 | 23.62,21.57 23.87,21.92 | 23.87,21.92 | v23.62,22.1 23.87,21.92 | 23.62,21.57 23.38,21.92 | v23.62,22.1 23.38,21.92 | 23.62,21.57 23.87,21.92 | v23.62,22.1 23.87,21.92 | 23.62,21.57 23.38,21.92 | v23.62,22.1 23.38,21.92 | 36.32,17.25 36.57,17.61 | 36.57,17.61 | 36.32,17.25 | 36.32,17.25 36.08,17.61 | 36.08,17.61 | 36.32,17.25 36.57,17.61 | 36.57,17.61 | v36.32,17.78 36.57,17.61 | 36.32,17.25 36.08,17.61 | v36.32,17.78 36.08,17.61 | 36.32,17.25 36.57,17.61 | v36.32,17.78 36.57,17.61 | 36.32,17.25 36.08,17.61 | v36.32,17.78 36.08,17.61
  Bottom 0.152: v36.32,17.78 35.8,17.78 | 35.8,17.78 | v23.62,22.1 24.15,22.1 | 24.15,22.1 25.53,22.1 arc-90 25.91,21.72 25.91,21.34 arc90 26.29,20.95 31.37,20.95 arc-90 32.13,20.19 32.13,18.41 arc90 32.77,17.78 35.8,17.78 | 24.15,22.1 23.8,22.34 v23.62,22.1 | 24.15,22.1 23.8,21.85 v23.62,22.1 | 35.8,17.78 | 35.8,17.78 36.15,17.53 | 36.15,17.53 | 35.8,17.78 36.15,18.03 | 36.15,18.03 | 35.8,17.78 36.15,17.53 | 36.15,17.53 | v36.32,17.78 36.15,17.53 | 35.8,17.78 36.15,18.03 | v36.32,17.78 36.15,18.03 | 35.8,17.78 36.15,17.53 | v36.32,17.78 36.15,17.53 | 35.8,17.78 36.15,18.03 | v36.32,17.78 36.15,18.03
ADXL372_CS  (via drill 0.3)
  Top 0.152: IC1.18 28.98,23.67 | 28.98,23.67 29.26,23.67 v29.46,23.88 | 34.81,20.83 35.56,20.83 arc90 36.67,21.94 IC3.8 | 34.81,20.83 | 34.81,20.83 v34.29,20.83 | 28.98,23.67 29.4,23.58 v29.46,23.88 | 28.98,23.67 29.21,24.04 v29.46,23.88 | 34.81,20.83 34.46,21.07 | 34.46,21.07 | 34.81,20.83 | 34.81,20.83 34.46,20.58 | 34.46,20.58 | 34.81,20.83 34.46,21.07 | 34.46,21.07 | v34.29,20.83 34.46,21.07 | 34.81,20.83 34.46,20.58 | v34.29,20.83 34.46,20.58 | 34.81,20.83 34.46,21.07 | v34.29,20.83 34.46,21.07 | 34.81,20.83 34.46,20.58 | v34.29,20.83 34.46,20.58
  Bottom 0.152: v29.46,23.88 29.46,23.35 | 29.46,23.35 29.46,22.23 arc90 29.84,21.84 32.51,21.84 arc-90 32.89,21.46 32.89,21.21 arc90 33.27,20.83 33.77,20.83 | v34.29,20.83 33.77,20.83 | 29.46,23.35 29.71,23.7 v29.46,23.88 | 29.46,23.35 29.22,23.7 v29.46,23.88 | 33.77,20.83 34.12,20.58 v34.29,20.83 | 33.77,20.83 34.12,21.07 v34.29,20.83
FLASH_MEMORY  (via drill 0.3)
  Top 0.152: IC6.1 9.53,36.45 arc-90 10.16,35.81 10.16,31.24 arc88 10.65,30.73 | 10.65,30.73 arc2 10.67,30.73 v11.18,30.73 | v28.12,25.68 28.11,25.67 27.59,25.67 | 27.59,25.67 IC1.22 | 10.65,30.73 11,30.49 v11.18,30.73 | 10.65,30.73 11,30.98 v11.18,30.73 | 27.59,25.67 27.95,25.43 v28.12,25.68 | 27.59,25.67 27.94,25.92 v28.12,25.68
  Bottom 0.152: v11.18,30.73 11.7,30.73 | 11.7,30.73 24.64,30.73 arc-90 25.32,30.05 25.32,26.64 arc90 26.29,25.68 27.59,25.68 | v28.12,25.68 27.59,25.68 | 11.7,30.73 11.35,30.98 v11.18,30.73 | 11.7,30.73 11.35,30.49 v11.18,30.73 | 27.59,25.68 27.94,25.43 v28.12,25.68 | 27.59,25.68 27.94,25.93 v28.12,25.68
GND  (via drill 0.3, 0.3 pad 0.4, 0.35)
  Top 0.152: 15.12,22.88 C18.1 | C5.1 39.91,13.24 | 37.79,15.75 IC2.5 | IC2.4 37.68,14.86 | C16.1 4.7,15.11 5.13,14.68 IC4.7 6.97,14.83 6.97,16.08 IC4.2 | 6.86,25.91 7.05,26.1 | C12.1 30.48,20.32 29.97,20.32 29.84,20.19 C11.1 28.59,20.01 27.97,19.39 | TR2.2 10.81,7.51 11.18,7.87 R4.1 | IC1.8 23.11,18.03 arc90 23.62,17.53 23.96,17.53 | C7.1 28.27,30.2 C15.1 28.27,27 27.44,26.17 IC1.23 | v24.49,17.53 v24.48,17.53 23.96,17.53 | 16.08,17.16 15.01,17.16 C1.1 | 16.08,17.16 16.8,17.16 C2.1 | C10.1 20.55,8.76 18.23,8.76 C9.1 18.05,8.94 16.08,10.9 16.08,17.16 | 24.84,10.37 C20.2 | 27.97,19.39 27.7,19.12 v27.52,19.12 | IC7.3 9.29,25.55 9.29,25.2 11.62,22.87 11.63,22.83 | C3.1 17.69,32.34 17.69,36.15 19.12,37.57 19.12,38.4 | 17.07,38.73 16.13,39.67 10.54,39.67 9.29,38.42 C17.1 | 17.07,38.73 17.08,38.73 | 28.41,32.58 28.41,34.24 26.33,36.33 | 28.41,32.58 28.41,32.17 v28.45,32.05 | 28.41,32.58 28.19,32.21 v28.45,32.05 | 28.41,32.58 28.68,32.24 v28.45,32.05 | 23.96,17.53 24.31,17.28 v24.49,17.53 | 23.96,17.53 24.31,17.77 v24.49,17.53 | 27.97,19.39 27.54,19.42 v27.52,19.12 | 27.97,19.39 27.8,19 v27.52,19.12 | IC1.35 20.11,29.05 v20.37,29.31 | CN1.2 19.3,39.96 19.3,39.1 19.12,38.92 19.12,38.4 | CN1.1 18.03,38.93 17.84,38.73 | 17.07,38.73 v17.14,38.73 17.84,38.73 | 17.84,38.73 18.17,38.4 19.12,38.4
  Top 0.254: IC3.16 35.67,27.32 arc90 35.31,27.69 C6.1 34.67,29.16 | C17.1 6.35,38.35 arc90 5.59,37.59 5.59,33.27 arc49 5.8,32.8 arc41 6.22,32.64 IC6.4 4.19,32.64 arc90 3.05,31.5 3.05,28.45 | IC7.3 9.29,26.15 arc90 9.02,26.42 8.58,26.42 | 8.58,26.42 7.37,26.42 arc90 7.05,26.1 arc-90 6.86,25.91 C23.1 5.61,25.91 | C25.1 32.38,32.54 C24.1 arc-90 32.21,32.72 32.21,33.35 arc90 31.98,33.58 31.22,33.58 arc-90 30.89,33.91 30.89,35.08 arc-90 31.24,35.43 IC8.2 | IC2.2 39.91,13.24 | IC2.5 arc-90 37.79,15.75 38.73,15.75 | 38.73,15.75 C4.1 40.03,15.77 41.27,15.77 41.45,15.6 41.45,13.76 | IC2.4 arc-90 37.68,14.86 38.48,14.86 arc90 38.73,15.11 38.73,15.75 | IC1.47 16.56,21.67 arc-90 16.13,22.1 16.13,22.48 arc90 15.85,22.76 C18.1 arc90 15.12,22.88 C19.1 11.95,22.88 arc90 11.94,22.86 11.81,22.86 arc21 11.63,22.83 arc69 11.3,22.35 11.3,21.46 arc-90 10.92,21.08 SW2.1 | 5.61,25.91 v5.08,25.91 | IC3.13 38.49,25.77 arc-90 38.73,25.53 arc-90 38.48,25.27 IC3.12 39.76,25.27 C14.1 40.03,24.99 C22.1 41.81,23.36 | C25.1 34.04,30.63 arc-90 34.67,30 34.67,29.16 | C25.1 32.38,29.63 | 32.38,29.63 v32.38,29.11 | v28.45,32.05 28.45,31.53 | 28.45,31.53 28.45,30.38 arc-90 C7.1 | C5.1 40.62,13.34 | 40.62,13.34 v41.15,13.34 | 41.45,13.76 41.45,13.64 v41.15,13.34 | v41.05,28.4 40.67,28.77 | 40.67,28.77 40.62,28.83 36.07,28.83 35.74,29.16 34.67,29.16 | C3.1 17.58,32.21 17.58,31.5 17.14,31.06 C8.1 16.23,30.35 15.16,29.28 | 41.81,23.36 v41.81,22.84 | 8.58,26.42 arc-90 8.56,26.43 8.56,28.07 arc90 8.18,28.45 v3.3,28.45 3.05,28.45 | 3.05,28.45 2.52,28.45 2.52,15.32 arc90 2.72,15.11 | R4.1 12.06,8.49 | 12.06,8.49 v12.06,9.02
  Top 0.254: C16.1 2.72,15.11 | 2.72,15.11 arc90 2.52,14.9 2.52,11.65 | v2.52,11.12 2.52,11.65 | v20.37,29.31 v20.37,29.3 20.37,29.1 20.11,28.85 20.12,29.31 v20.37,29.31 | 15.16,29.28 14.89,29.01 v14.71,29.01 | R7.2 28.48,4.19 arc-90 28.48,4.19 | C10.1 21.72,8.76 arc90 22.1,9.14 22.1,9.86 arc-90 22.61,10.37 22.89,10.37 | v23.42,10.37 22.89,10.37 | v23.42,10.37 23.94,10.37 | 23.94,10.37 24.84,10.37 | C20.2 C21.2 28.07,10.48 28.48,10.06 28.48,4.19 | v24.49,17.53 25.01,17.53 | 25.01,17.53 26.82,17.53 32.89,11.45 C13.1 35.18,8.51 35.18,4.05 | 5.61,25.91 5.2,26.13 v5.08,25.91 | 5.61,25.91 5.2,25.69 v5.08,25.91 | 32.38,29.63 32.16,29.23 v32.38,29.11 | 32.38,29.63 32.61,29.23 v32.38,29.11 | 28.45,31.53 28.67,31.93 v28.45,32.05 | 28.45,31.53 28.23,31.93 v28.45,32.05 | 25.01,17.53 24.61,17.75 v24.49,17.53 | 25.01,17.53 24.61,17.31 v24.49,17.53 | 40.62,13.34 41.03,13.11 v41.15,13.34 | 40.62,13.34 41.03,13.56 v41.15,13.34 | 41.45,13.76 41.04,13.56 v41.15,13.34 | 41.45,13.76 41.4,13.3 v41.15,13.34 | 41.81,23.36 41.59,22.95 v41.81,22.84 | 41.81,23.36 42.03,22.95 v41.81,22.84 | 40.67,28.77 40.8,28.33 v41.05,28.4 | 40.67,28.77 41.12,28.64 v41.05,28.4 | v20.37,29.31 20.5,29.09 | 12.06,8.49 12.29,8.9 v12.06,9.02 | 12.06,8.49 11.84,8.9 v12.06,9.02 | 2.52,11.65 2.29,11.24 v2.52,11.12 | 2.52,11.65 2.73,11.24 v2.52,11.12 | 22.89,10.37 23.3,10.14 v23.42,10.37 | 22.89,10.37 23.3,10.59 v23.42,10.37 | 23.94,10.37 23.54,10.59 v23.42,10.37 | 23.94,10.37 23.54,10.14 v23.42,10.37 | 15.16,29.28 14.7,29.26 v14.71,29.01 | 15.16,29.28 14.92,28.88 v14.71,29.01 | 35.18,4.05 SW1.3 28.62,4.05 28.48,4.19 | 35.18,4.05 SW1.4
  Bottom 0.254: v5.08,25.91 5.08,25.38 | 5.08,25.38 5.08,23.75 arc90 5.71,23.11 BT2.- | v32.38,29.11 32.38,28.58 | 32.38,28.58 32.38,28.42 arc-90 31.75,27.79 28.93,27.79 arc-90 28.42,28.3 28.42,31.53 | 28.42,31.53 28.42,32.03 arc-90 v28.45,32.05 | v41.15,13.34 41.52,13.71 | 41.52,13.71 41.81,13.99 41.81,22.31 | 41.81,22.31 v41.81,22.84 | v41.05,28.4 41.05,28.37 41.3,28.12 41.3,27.94 | v41.81,22.84 41.44,23.21 | 41.44,23.21 41.3,23.34 41.3,27.94 | v12.06,9.02 11.54,9.02 | 11.54,9.02 3.66,9.02 arc-90 2.52,10.16 2.52,10.6 | 2.52,10.6 2.52,11.02 arc90 2.49,11.05 2.49,11.1 arc-90 v2.52,11.12 | v24.49,17.53 24.49,17 | 24.49,17 24.49,15.82 23.42,14.76 23.42,10.89 | v23.42,10.37 23.42,10.89 | v24.49,17.53 v24.48,17.52 23.96,17.52 | v14.71,29.01 15.01,29.31 15.14,29.31 | 15.14,29.31 19.85,29.31 | v27.52,19.12 27.52,18.6 | 27.52,18.6 27.52,16.19 30.56,13.15 40.66,13.15 | v41.15,13.34 40.97,13.15 40.66,13.15 | 5.08,25.38 5.3,25.79 v5.08,25.91 | 5.08,25.38 4.86,25.79 v5.08,25.91 | 32.38,28.58 32.61,28.99 v32.38,29.11 | 32.38,28.58 32.16,28.99 v32.38,29.11 | 28.42,31.53 28.66,31.92 v28.45,32.05 | 28.42,31.53 28.22,31.95 v28.45,32.05 | 24.49,17 24.71,17.41 v24.49,17.53 | 24.49,17 24.27,17.41 | 23.96,17.52 24.37,17.31 v24.49,17.53 | 23.96,17.52 24.36,17.75 v24.49,17.53 | 41.52,13.71 41.08,13.58 v41.15,13.34 | 41.52,13.71 41.39,13.26 v41.15,13.34 | 40.66,13.15 41.11,13.09 v41.15,13.34 | 40.66,13.15 40.96,13.5 v41.15,13.34 | 41.81,22.31 42.03,22.71 v41.81,22.84 | 41.81,22.31 41.59,22.71 v41.81,22.84 | 41.44,23.21 41.57,22.76 v41.81,22.84 | 41.44,23.21 41.88,23.08 v41.81,22.84 | 41.3,27.94 41.3,28.4 v41.05,28.4 | 41.3,27.94 40.91,28.18 v41.05,28.4
  Bottom 0.254: v20.37,29.31 20.4,29.29 20.12,28.78 19.95,29.08 v20.37,29.31 | 19.85,29.31 20.25,29.09 v20.37,29.31 | 19.85,29.31 20.25,29.53 v20.37,29.31 | 27.52,18.6 27.74,19 v27.52,19.12 | 27.52,18.6 27.3,19 v27.52,19.12 | 11.54,9.02 11.95,8.8 v12.06,9.02 | 11.54,9.02 11.95,9.24 v12.06,9.02 | 2.52,10.6 2.73,11.01 v2.52,11.12 | 2.52,10.6 2.29,11.01 v2.52,11.12 | 23.42,10.89 23.2,10.48 v23.42,10.37 | 23.42,10.89 23.64,10.48 v23.42,10.37 | 15.14,29.31 14.68,29.26 v14.71,29.01 | 15.14,29.31 14.93,28.89 v14.71,29.01
  other vias: 5.08,29.98 1.91,36.2 1.91,33.02 5.71,35.56 5.71,33.02 9.14,33.27 9.4,31.5 11.43,31.75 13.97,31.75 10.79,36.83 7.11,29.97 8.64,28.45 1.91,29.84 1.91,26.67 3.3,26.67 11.68,24.26 13.34,24.13 1.91,22.86 3.3,22.99 8.89,17.78 5.71,17.78 3.3,19.43 1.91,19.68 1.91,16.51 5.08,22.61 5.33,19.56 1.91,13.34 7.62,10.92 5.71,10.79 3.81,9.53 1.91,8.89 12.83,10.92 1.65,5.71 3.17,6.35 6.99,5.08 10.16,5.08 13.34,5.08 6.99,1.91 10.16,1.91 13.34,1.91 16.51,1.91 16.51,8.89 16.51,5.71 18.41,7.62 21.59,7.62 21.59,5.08 18.41,5.08 19.68,1.91 22.86,1.91 24.77,8.26 26.04,1.91 29.21,1.91 33.02,1.91 36.2,1.91 39.37,1.91 43.18,5.71 43.18,8.89 28.57,13.34 31.11,13.34 37.47,10.79 41.24,10.79 43.18,12.06 40.77,6.1 43.43,16.26 14.61,13.97 15.24,15.62 17.78,15.88 19.68,17.78 23.5,14.61 27.94,17.14 42.55,18.41 39.37,18.41 40.01,20.18 42.55,21.59 43.48,28.04 43.48,30.48 43.48,33.02 37.9,34.29 39.37,34.29 40.01,30.48 37.47,30.48 35.56,33.02 43.48,35.99 34.29,29.21 43.18,39.37 39.37,40.64 38.73,43.18 35.56,43.18 35.56,40.64 32.38,43.18 32.38,40.64 30.48,43.18 30.48,40.64 31.75,38.73 28.07,38.53 22.32,42.08 17.75,37.41 15.24,40.01 14.61,42.55 13.59,41.15 12.06,43.18 12.32,39.24 13.84,37.59 8.89,43.18 5.71,43.18 5.08,40.01 6.99,40.64 6.35,38.1 1.91,39.37 25.6,37.5 18.7,42.1 26,42.1 21.84,25.53
  pour Bottom: 0,0 44.45,0 44.45,44.45 0,44.45
  pour Bottom: 24.77,15.24 24.13,15.24 24.13,12.7 27.94,12.7 27.94,15.24
  cutout Bottom: 16.51,15.24 16.51,11.43 22.23,11.43 22.23,15.24
  cutout Bottom: 24.13,15.24 27.94,15.24 27.94,12.7 24.13,12.7
  pour Top: 0.64,0.64 44.45,0.64 44.45,44.45 0.64,44.45
  cutout Top: 16.51,15.24 16.51,11.43 22.23,11.43 22.23,15.24
  cutout Top: 24.13,15.24 24.13,12.7 27.94,12.7 27.94,15.24
  cutout Top: 19.43,18.54 20.45,18.54 20.45,19.05 19.43,19.05
  cutout Top: 26.11,27.99 24.79,26.67 24.79,26.26 24.79,25.91 25.45,25.25 25.96,25.25 26.21,25.5 26.21,25.6 26.21,26.72 26.26,26.77 27.08,26.77 27.08,27.18 27.03,27.23 26.26,27.99
  cutout Top: 35.6,15.7 37,15.7 37,13.2 35.6,13.2
  cutout Top: 30.2,37 30.2,35.9 31.5,35.9 31.5,37
  cutout Top: 40.1,26.5 40.1,25.6 42.9,25.6 42.9,26.5
  cutout Bottom: 25.78,26.42 22.86,26.42 22.86,20.83 22.99,20.7 24.38,20.7 24.38,19.18 24.51,19.05 26.8,19.05 26.8,19.81 29.21,19.81 29.34,19.94 29.34,26.16 29.21,26.29 29.08,26.42
I2C1_SCL  (via drill 0.3)
  Top 0.152: IC4.6 7.87,13.18 7.87,12.45 8.13,12.19 9.4,12.19 9.65,12.45 R2.1 9.65,13.97 9.91,14.22 11.94,14.22 12.46,14.74 | v12.83,15.11 12.46,14.74 | v14.99,24.38 15.2,24.17 15.46,24.17 | 15.46,24.17 IC1.42 | 15.46,24.17 15.24,24.54 v14.99,24.38 | 15.46,24.17 15.04,24.09 v14.99,24.38 | 12.46,14.74 12.88,14.81 v12.83,15.11 | 12.46,14.74 12.53,15.16 v12.83,15.11
  Bottom 0.152: v12.83,15.11 12.3,15.11 | 12.3,15.11 11.43,15.11 arc-90 10.41,16.13 10.41,19.56 arc-90 10.92,20.07 13.08,20.07 arc90 14.99,21.97 14.99,23.86 | 14.99,23.86 v14.99,24.38 | 14.99,23.86 15.23,24.21 v14.99,24.38 | 14.99,23.86 14.74,24.21 v14.99,24.38 | 12.3,15.11 12.65,14.87 v12.83,15.11 | 12.3,15.11 12.65,15.36 v12.83,15.11
I2C1_SDA  (via drill 0.3)
  Top 0.152: IC4.1 7.83,16.72 8.13,17.02 9.4,17.02 | R3.1 9.78,16.64 9.4,17.02 | v11.43,17.4 11.06,17.03 | 11.06,17.03 11.05,17.02 9.4,17.02 | v16.87,23.1 16.87,23.48 arc-90 17.07,23.67 IC1.43 | 11.06,17.03 11.48,17.1 v11.43,17.4 | 11.06,17.03 11.13,17.45 v11.43,17.4 | v16.87,23.1 16.65,23.3 16.93,23.62 17.14,23.24 v16.87,23.1
  Bottom 0.152: 11.43,17.92 | 11.43,17.92 v11.43,17.4 | 11.43,17.92 11.43,19.05 arc-90 11.94,19.56 13.08,19.56 arc90 15.62,22.1 15.62,22.61 arc-90 16.11,23.1 16.35,23.1 | 16.35,23.1 v16.87,23.1 | 11.43,17.92 | 11.43,17.92 11.18,17.57 | 11.18,17.57 | 11.43,17.92 11.68,17.57 | 11.68,17.57 | 11.43,17.92 11.18,17.57 | 11.18,17.57 | v11.43,17.4 11.18,17.57 | 11.43,17.92 11.68,17.57 | v11.43,17.4 11.68,17.57 | 11.43,17.92 11.18,17.57 | v11.43,17.4 11.18,17.57 | 11.43,17.92 11.68,17.57 | v11.43,17.4 11.68,17.57 | 16.35,23.1 16.7,22.85 v16.87,23.1 | 16.35,23.1 16.7,23.34 v16.87,23.1
MODE_LED  (via drill 0.3)
  Top 0.152: IC1.39 12.68,25.67 arc-90 12.19,26.16 12.19,27.94 arc90 10.92,29.21 4.72,29.21 | 4.72,29.21 v4.19,29.21 | v13.97,10.41 13.97,9.89 | 13.97,9.89 R5.1 | 4.72,29.21 4.37,29.46 v4.19,29.21 | 4.72,29.21 4.37,28.96 v4.19,29.21 | 13.97,9.89 14.22,10.24 v13.97,10.41 | 13.97,9.89 13.72,10.24 v13.97,10.41
  Bottom 0.152: v4.19,29.21 4.19,28.68 | 4.19,28.68 4.19,12.7 arc90 5.08,11.81 13.34,11.81 arc-90 13.97,11.18 13.97,10.94 | 13.97,10.94 v13.97,10.41 | 4.19,28.68 4.44,29.04 v4.19,29.21 | 4.19,28.68 3.94,29.04 v4.19,29.21 | 13.97,10.94 13.72,10.59 v13.97,10.41 | 13.97,10.94 14.22,10.59 v13.97,10.41
MODE_SW
  Top 0.152: IC1.40 12.29,25.17 arc-90 10.92,26.54 10.92,27.3 arc90 10.29,27.94 9.53,27.94 arc90 9.29,27.7 IC7.4
N$1
  Top 0.152: C9.2 18.16,12.29 X1.2 20.61,16.55 IC1.3
N$2
  Top 0.152: IC1.4 21.11,13.65 X1.1 20.7,12.32 C10.2
N$4
  Top 0.152: TR2.1 11.03,6.21 11.18,6.35 R4.2 R5.2
N$5
  Top 0.152: 8.64,24.38 8.64,23.62 8.13,23.11 6.35,23.11 6.1,22.86 6.1,21.2 SW2.2 | 8.64,24.38 IC7.2 | R6.1 8.38,24.13 8.64,24.38
N$6  (via drill 0.3)
  Top 0.152: v23.62,24.13 23.62,23.61 | 23.62,23.61 23.62,23.5 arc90 24.38,22.73 24.77,22.73 arc-90 25.4,22.1 25.4,21.46 25.69,21.17 IC1.13 | 23.62,23.61 23.87,23.96 v23.62,24.13 | 23.62,23.61 23.38,23.96 v23.62,24.13
  Bottom 0.152: v23.62,24.13 arc-90 24.26,24.77 29.07,24.77 arc90 29.45,25.15 29.45,26.18 arc-90 30.43,27.16 32.17,27.16 arc90 33.24,28.23 33.24,38.78 TP3.TP | v23.62,24.13 23.47,24.39 23.84,24.61 23.92,24.19 v23.62,24.13
N$7  (via drill 0.3)
  Top 0.152: v15.49,38.86 arc-90 15.75,38.61 15.75,38.4 | IC1.38 arc-90 IC1.38 13.72,26.16 arc-90 13.08,26.8 13.08,29.59 arc-90 13.84,30.35 14.86,30.35 arc90 15.75,31.24 15.75,38.4 | 15.75,38.4 15.79,38.83 v15.49,38.86 | 15.75,38.4 15.36,38.59 v15.49,38.86
  Bottom 0.152: TP4.TP 13.97,41.91 arc-90 14.35,41.53 14.35,39.37 arc90 14.86,38.86 14.97,38.86 | 14.97,38.86 v15.49,38.86 | 14.97,38.86 15.32,38.62 v15.49,38.86 | 14.97,38.86 15.32,39.11 v15.49,38.86
N$12  (via drill 0.3)
  Top 0.152: IC1.44 19.61,23.17 20,23.56 | v27.23,7.75 arc-90 27.26,7.72 | 27.26,7.72 27.26,7.22 | 27.26,7.22 R7.1 | R8.1 24.87,7.11 arc-90 25.51,7.75 26.71,7.75 | 26.71,7.75 v27.23,7.75 | v27.23,7.75 arc-90 27.26,7.72 | v20.37,23.93 20,23.56 | 20,23.56 20.42,23.63 v20.37,23.93 | 20,23.56 20.07,23.98 v20.37,23.93 | 27.26,7.22 27.49,7.59 v27.23,7.75 | 27.26,7.22 27,7.56 v27.23,7.75 | 26.71,7.75 27.06,7.5 v27.23,7.75 | 26.71,7.75 27.06,8 v27.23,7.75
  Bottom 0.152: v20.37,23.93 21.39,23.93 arc-90 22.07,23.24 22.07,19.61 arc90 22.91,18.77 25.86,18.77 arc-90 26.85,17.78 26.85,10.16 27.21,9.8 27.21,8.27 | 27.21,8.27 27.21,7.77 arc90 v27.23,7.75 | v20.37,23.93 20.56,24.16 20.89,23.9 20.53,23.67 v20.37,23.93 | 27.21,8.27 26.98,7.91 v27.23,7.75 | 27.21,8.27 27.47,7.93 v27.23,7.75
N$14
  Top 0.152: C20.1 24.97,12.78 25.17,12.98 X2.2 25.17,15.29 arc90 24.74,15.72 22.84,15.72 arc-90 21.61,16.94 IC1.5
N$15
  Top 0.152: IC1.6 22.11,17.1 arc90 23.04,16.18 25.68,16.18 arc-90 26.67,15.19 X2.1 26.67,12.95 27.18,12.45 27.18,12.03 C21.1
N$18
  Top 0.152: D1.+ 4.32,6.86 4.06,7.11 4.06,8.38 4.45,8.76 R1.1
N$19
  Top 0.152: TR2.3 D1.-
RESET  (via drill 0.35)
  Top 0.152: IC1.7 22.61,17.44 arc90 23.42,16.64 26.42,16.64 v30.73,12.32 31.37,11.68 C13.2 31.43,10.73 31.43,10.1 30.73,9.39 SW1.1
  Bottom 0.152: v30.73,12.32 29.57,11.15 TP8.TP
SPI1_MISO  (via drill 0.3)
  Top 0.152: IC1.16 31.31,22.67 31.38,22.74 | 31.38,22.74 v31.75,23.11 | IC2.12 33.5,13.24 31.75,14.99 31.75,16.26 33.56,18.06 33.56,20.95 arc-90 34.19,21.59 34.53,21.59 | v35.05,21.59 34.53,21.59 | 34.53,21.59 | IC3.7 36.17,21.94 arc-90 35.81,21.59 35.58,21.59 | v35.05,21.59 35.58,21.59 | 35.58,21.59 | 31.38,22.74 31.8,22.82 v31.75,23.11 | 31.38,22.74 31.45,23.17 v31.75,23.11 | 34.53,21.59 | 34.53,21.59 34.88,21.34 | 34.88,21.34 | 34.53,21.59 34.88,21.84 | 34.88,21.84 | 35.58,21.59 35.23,21.84 | 35.23,21.84 | 35.58,21.59 | 35.58,21.59 35.23,21.34 | 35.23,21.34 | 34.53,21.59 34.88,21.34 | 34.88,21.34 | v35.05,21.59 34.88,21.34 | 34.53,21.59 34.88,21.84 | v35.05,21.59 34.88,21.84 | 34.53,21.59 34.88,21.34 | v35.05,21.59 34.88,21.34 | 34.53,21.59 34.88,21.84 | v35.05,21.59 34.88,21.84 | 35.58,21.59 35.23,21.84 | 35.23,21.84 | v35.05,21.59 35.23,21.84 | 35.58,21.59 35.23,21.34 | v35.05,21.59 35.23,21.34 | 35.58,21.59 35.23,21.84 | v35.05,21.59 35.23,21.84 | 35.58,21.59 35.23,21.34 | v35.05,21.59 35.23,21.34
  Bottom 0.152: v31.75,23.11 32.27,23.11 | 32.27,23.11 | 32.27,23.11 32.51,23.11 34.04,21.59 34.53,21.59 | 34.53,21.59 | 34.53,21.59 v35.05,21.59 | 32.27,23.11 31.92,23.36 | 31.92,23.36 | 32.27,23.11 | 32.27,23.11 31.92,22.87 | 31.92,22.87 | 32.27,23.11 31.92,23.36 | 31.92,23.36 | v31.75,23.11 31.92,23.36 | 32.27,23.11 31.92,22.87 | v31.75,23.11 31.92,22.87 | 32.27,23.11 31.92,23.36 | v31.75,23.11 31.92,23.36 | 32.27,23.11 31.92,22.87 | v31.75,23.11 31.92,22.87 | 34.53,21.59 | 34.53,21.59 34.88,21.34 | 34.88,21.34 | 34.53,21.59 34.88,21.84 | 34.88,21.84 | 34.53,21.59 34.88,21.34 | 34.88,21.34 | v35.05,21.59 34.88,21.34 | 34.53,21.59 34.88,21.84 | v35.05,21.59 34.88,21.84 | 34.53,21.59 34.88,21.34 | v35.05,21.59 34.88,21.34 | 34.53,21.59 34.88,21.84 | v35.05,21.59 34.88,21.84
SPI1_MOSI  (via drill 0.3)
  Top 0.152: IC1.17 30.03,23.17 30.36,23.5 | 30.36,23.5 v30.73,23.88 | 33.84,22.08 34.11,22.35 v34.29,22.35 | 33.84,22.08 33.12,21.36 33.12,18.32 31.19,16.38 31.19,14.86 33.63,12.42 IC2.13 | 34.81,22.35 35.31,22.35 arc90 35.67,22.71 IC3.6 | 34.81,22.35 | 34.81,22.35 v34.29,22.35 | 30.36,23.5 30.79,23.58 v30.73,23.88 | 30.36,23.5 30.44,23.93 v30.73,23.88 | 34.81,22.35 34.46,22.6 | 34.46,22.6 | 34.81,22.35 | 34.81,22.35 34.46,22.11 | 34.46,22.11 | 33.84,22.08 34.27,22.05 v34.29,22.35 | 33.84,22.08 34.01,22.47 v34.29,22.35 | 34.81,22.35 34.46,22.6 | 34.46,22.6 | v34.29,22.35 34.46,22.6 | 34.81,22.35 34.46,22.11 | v34.29,22.35 34.46,22.11 | 34.81,22.35 34.46,22.6 | v34.29,22.35 34.46,22.6 | 34.81,22.35 34.46,22.11 | v34.29,22.35 34.46,22.11
  Bottom 0.152: v30.73,23.88 30.83,23.98 31.25,23.98 | 33.92,22.72 32.67,23.98 31.25,23.98 | 33.92,22.72 v34.29,22.35 | 31.25,23.98 30.86,24.15 v30.73,23.88 | 31.25,23.98 30.95,23.67 v30.73,23.88 | 33.92,22.72 33.99,22.3 v34.29,22.35 | 33.92,22.72 34.34,22.65 v34.29,22.35
SPI1_SCK
  Top 0.152: IC1.15 32.08,22.17 | IC3.4 34.17,24.27 32.08,22.17 | IC2.14 36.29,11.65 36.07,11.43 33.94,11.43 30.63,14.73 30.63,16.41 32.51,18.29 32.51,21.73 32.08,22.17
SPI2_MISO  (via drill 0.3)
  Top 0.152: IC6.2 8.76,35.18 arc-90 9.22,34.72 v9.22,34.59 | IC1.27 24.11,32.17 arc-90 24.46,32.51 24.89,32.51 arc90 25.22,32.84 25.22,34.04 | 25.22,34.04 v25.22,34.57 | v9.22,34.59 8.93,34.67 9.04,35.09 9.39,34.84 v9.22,34.59 | 25.22,34.04 25.47,34.4 v25.22,34.57 | 25.22,34.04 24.98,34.4 v25.22,34.57
  Bottom 0.152: v25.22,34.57 24.7,34.57 | 24.7,34.57 9.74,34.57 | 9.74,34.57 9.25,34.57 v9.22,34.59 | 9.74,34.57 9.41,34.83 v9.22,34.59 | 9.74,34.57 9.38,34.34 v9.22,34.59 | 24.7,34.57 25.05,34.32 v25.22,34.57 | 24.7,34.57 25.05,34.82 v25.22,34.57
SPI2_MOSI  (via drill 0.3)
  Top 0.152: IC6.5 14.16,32.64 | 14.16,32.64 14.68,32.64 v14.68,32.61 | IC1.28 23.61,32.8 arc-11 23.62,32.88 | 23.62,32.88 arc-79 v24.03,33.21 | 14.16,32.64 14.5,32.38 v14.68,32.61 | 14.16,32.64 14.52,32.87 v14.68,32.61 | 23.62,32.88 24.05,32.91 v24.03,33.21 | 23.62,32.88 23.74,33.29 v24.03,33.21
  Bottom 0.152: v24.03,33.21 23.5,33.21 | 23.5,33.21 15.28,33.21 15.05,32.98 | v14.68,32.61 15.05,32.98 | 15.05,32.98 14.63,32.91 v14.68,32.61 | 15.05,32.98 14.98,32.56 v14.68,32.61 | 23.5,33.21 23.86,32.96 v24.03,33.21 | 23.5,33.21 23.86,33.46 v24.03,33.21
SPI2_SCK  (via drill 0.3)
  Top 0.152: IC6.6 14.21,33.91 | 14.21,33.91 v14.73,33.91 | IC1.26 24.61,31.35 24.65,31.38 | v25.02,31.75 24.65,31.38 | 14.21,33.91 14.56,33.66 v14.73,33.91 | 14.21,33.91 14.56,34.16 v14.73,33.91 | 24.65,31.38 25.07,31.45 v25.02,31.75 | 24.65,31.38 24.72,31.8 v25.02,31.75
  Bottom 0.152: v14.73,33.91 15.26,33.91 | 15.26,33.91 24.51,33.91 arc-90 25.02,33.4 25.02,32.27 | 25.02,32.27 v25.02,31.75 | 15.26,33.91 14.91,34.16 v14.73,33.91 | 15.26,33.91 14.91,33.66 v14.73,33.91 | 25.02,32.27 24.77,31.92 v25.02,31.75 | 25.02,32.27 25.27,31.92 v25.02,31.75
SYS_SWCLK
  Top 0.152: TP2.TP 16.26,27.18 16.76,26.67 IC1.37
SYS_SWDIO
  Top 0.152: TP1.TP 17.53,28.7 19.3,26.92 20.32,26.92 20.61,27.22 IC1.34
TP5  (via drill 0.3)
  Top 0.152: v26.42,33.77 26.05,33.4 | 26.05,33.4 25.73,33.09 25.73,27.7 20.7,22.67 IC1.45 | 26.05,33.4 26.47,33.48 v26.42,33.77 | 26.05,33.4 26.12,33.83 v26.42,33.77
  Bottom 0.152: 26.42,34.3 26.42,35.1 25.78,35.74 13.36,35.74 11.44,37.66 11.44,40.21 TP5.TP | 26.42,34.3 v26.42,33.77 | 26.42,34.3 26.17,33.95 v26.42,33.77 | 26.42,34.3 26.67,33.95 v26.42,33.77
TP6  (via drill 0.3)
  Top 0.152: IC1.46 19.23,22.17 19.56,21.84 19.56,21.08 18.76,20.29 | 18.76,20.29 18.55,20.07 v18.28,20.07 | 18.76,20.29 18.34,20.37 v18.28,20.07 | 18.76,20.29 18.54,19.92 v18.28,20.07
  Bottom 0.152: 18.28,20.6 18.28,23.4 13.48,28.21 13.46,28.19 11.43,28.19 8.4,31.23 8.4,38.96 9.83,40.39 9.83,41.82 TP6.TP | 18.28,20.6 v18.28,20.07 | 18.28,20.6 18.04,20.24 v18.28,20.07 | 18.28,20.6 18.53,20.24 v18.28,20.07
TP7  (via drill 0.3)
  Top 0.152: v24.84,25.73 25.21,25.36 | 25.21,25.36 25.38,25.2 26.45,25.2 IC1.21 | v8.3,30.02 8.83,30.02 | 8.83,30.02 11.45,30.02 | 11.45,30.02 v11.97,30.02 | 25.21,25.36 25.14,25.79 v24.84,25.73 | 25.21,25.36 24.79,25.43 v24.84,25.73 | 11.45,30.02 11.8,29.77 v11.97,30.02 | 11.45,30.02 11.8,30.27 v11.97,30.02 | 8.83,30.02 8.48,30.27 v8.3,30.02 | 8.83,30.02 8.48,29.77 v8.3,30.02
  Bottom 0.152: v11.97,30.02 12.5,30.02 | 12.5,30.02 22.05,30.02 arc-90 23.11,28.96 23.11,26.67 arc90 24.05,25.73 24.31,25.73 | v8.3,30.02 8.3,30.05 7.95,30.41 | 7.95,30.41 7.53,30.82 7.53,39.52 8.22,40.21 TP7.TP | v24.84,25.73 24.31,25.73 | 24.31,25.73 24.67,25.49 v24.84,25.73 | 24.31,25.73 24.67,25.98 v24.84,25.73 | 12.5,30.02 12.15,30.27 v11.97,30.02 | 12.5,30.02 12.15,29.77 v11.97,30.02 | 7.95,30.41 8.01,29.98 v8.3,30.02 | 7.95,30.41 8.37,30.32 v8.3,30.02
USART1_CK
  Top 0.152: IC1.29 23.11,33.43 23.11,36.47 25.53,38.89 CN1.7
USART1_CTS
  Top 0.152: IC1.32 21.61,38.26 21.78,38.42 CN1.4
USART1_RTS
  Top 0.152: IC1.33 21.11,37.59 20.53,38.18 CN1.3
USART1_RX
  Top 0.152: IC1.31 22.11,37.91 23.03,38.83 CN1.5
USART1_TX
  Top 0.152: IC1.30 22.61,37.35 24.28,39.01 CN1.6